# Altium project fast-open-switch r1.0.PrjPcb (part 6 of 8)

## Sheet I2C Multiplexer.SchDoc
size A3; SheetNumber: 17; SheetTotal: 22
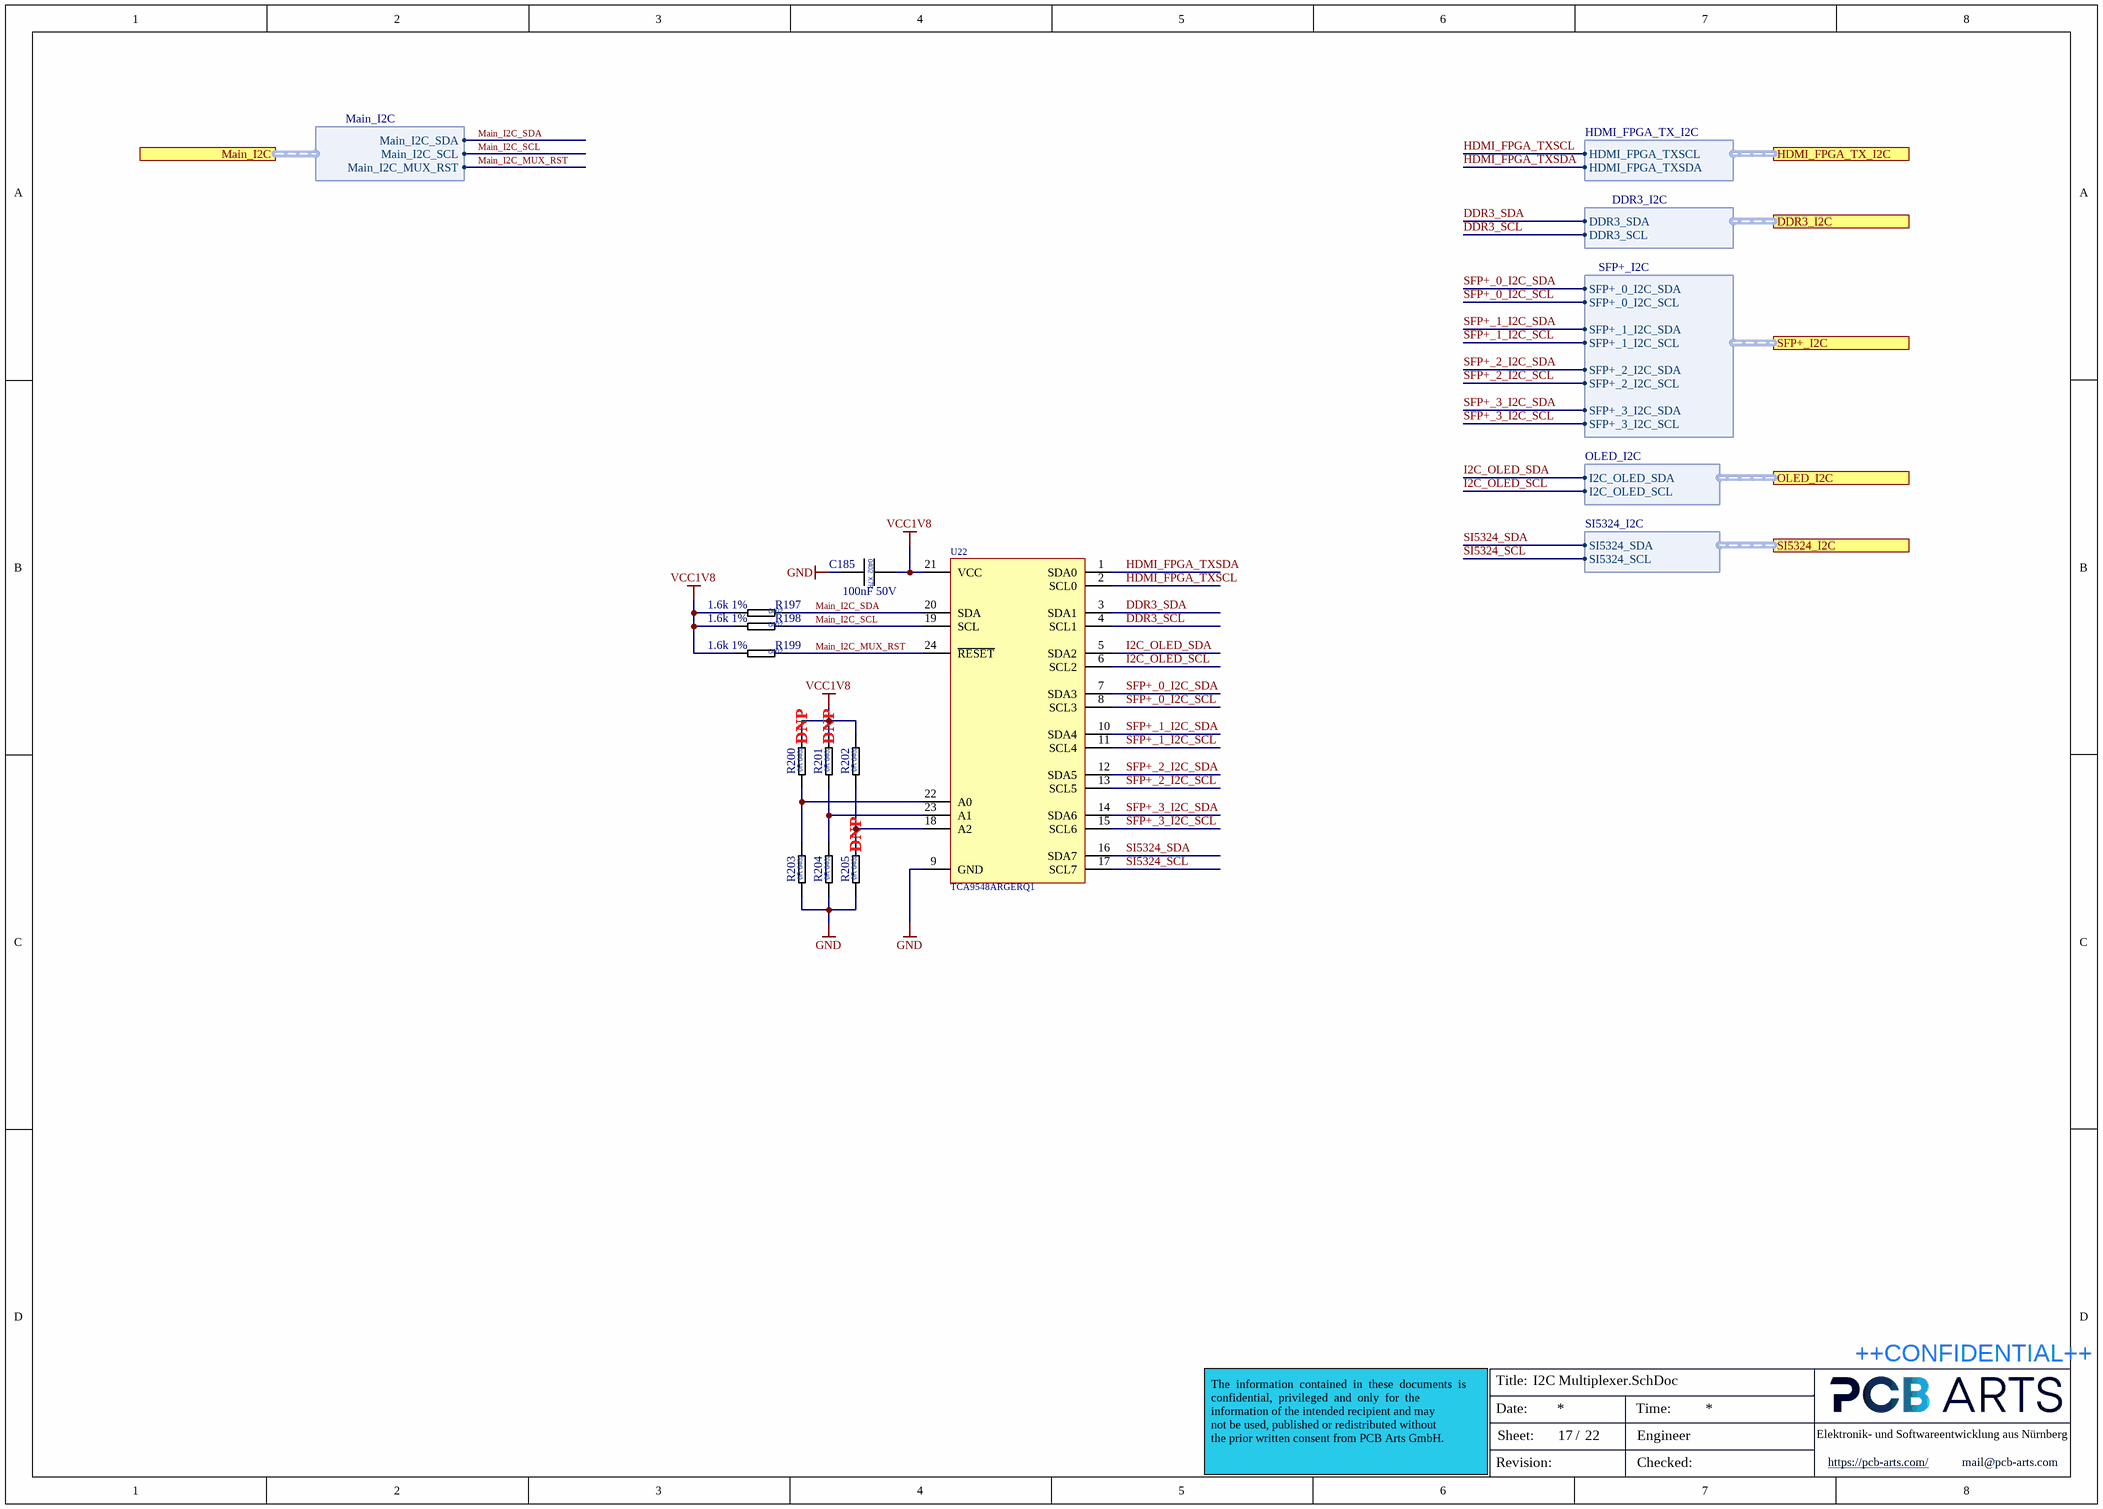
[diagram p16: I2C Multiplexer.SchDoc]

### Parts
C185  100nF 50V  [CAP_0402_L]
R197  1.6k 1%  [RES_0402_L]
R198  1.6k 1%  [RES_0402_L]
R199  1.6k 1%  [RES_0402_L]
R200  0R Jumper  [RES_0402_L]  (value not drawn)  (no BOM)
R201  0R Jumper  [RES_0402_L]  (value not drawn)  (no BOM)
R202  0R Jumper  [RES_0402_L]  (value not drawn)
R203  0R Jumper  [RES_0402_L]  (value not drawn)
R204  0R Jumper  [RES_0402_L]  (value not drawn)
R205  0R Jumper  [RES_0402_L]  (value not drawn)  (no BOM)
U22  TCA9548ARGERQ1  [QFN50P400X400X100-25N]

### Ports
DDR3_I2C (harness DDR3_I2C, see Top-Level-Sheet[6C], DDR3 Memory_SO-DIMM[8C]), HDMI_FPGA_TX_I2C (harness HDMI_FPGA_TX_I2C, see Top-Level-Sheet[6C], Bank 13_Bank 15_Bank 16[8C]), Main_I2C (harness Main_I2C, see Top-Level-Sheet[6C], SMI Bank 12[1B]), OLED_I2C (harness OLED_I2C, see Top-Level-Sheet[6C], HMI[1A]), SFP+_I2C (harness SFP+_I2C, see Top-Level-Sheet[6C], SFP+_Connectors[8B]), SI5324_I2C (harness SI5324_I2C, see Top-Level-Sheet[6C], System Clocks[1A])

### Harnesses
HDMI_FPGA_TX_I2C: HDMI_FPGA_TXSCL, HDMI_FPGA_TXSDA
DDR3_I2C: DDR3_SDA, DDR3_SCL
SFP+_I2C: SFP+_3_I2C_SDA, SFP+_3_I2C_SCL, SFP+_0_I2C_SDA, SFP+_0_I2C_SCL, SFP+_1_I2C_SDA, SFP+_1_I2C_SCL, SFP+_2_I2C_SDA, SFP+_2_I2C_SCL
OLED_I2C: I2C_OLED_SDA, I2C_OLED_SCL
Main_I2C: Main_I2C_SCL, Main_I2C_MUX_RST, Main_I2C_SDA
SI5324_I2C: SI5324_SDA, SI5324_SCL

### Nets
GND: C185.2 R203.1 R204.1 R205.1 U22.9(GND)
VCC1V8: C185.1 R197.2 R198.2 R199.2 R200.2 R201.2 R202.2 U22.21(VCC)
DDR3_SCL: U22.4(SCL1) ; port DDR3_I2C.DDR3_SCL
DDR3_SDA: U22.3(SDA1) ; port DDR3_I2C.DDR3_SDA
HDMI_FPGA_TXSCL: U22.2(SCL0) ; port HDMI_FPGA_TX_I2C.HDMI_FPGA_TXSCL
HDMI_FPGA_TXSDA: U22.1(SDA0) ; port HDMI_FPGA_TX_I2C.HDMI_FPGA_TXSDA
I2C_OLED_SCL: U22.6(SCL2) ; port OLED_I2C.I2C_OLED_SCL
I2C_OLED_SDA: U22.5(SDA2) ; port OLED_I2C.I2C_OLED_SDA
Main_I2C_MUX_RST: R199.1 U22.24(~{RESET}) ; port Main_I2C.Main_I2C_MUX_RST
Main_I2C_SCL: R198.1 U22.19(SCL) ; port Main_I2C.Main_I2C_SCL
Main_I2C_SDA: R197.1 U22.20(SDA) ; port Main_I2C.Main_I2C_SDA
SFP+_0_I2C_SCL: U22.8(SCL3) ; port SFP+_I2C.SFP+_0_I2C_SCL
SFP+_0_I2C_SDA: U22.7(SDA3) ; port SFP+_I2C.SFP+_0_I2C_SDA
SFP+_1_I2C_SCL: U22.11(SCL4) ; port SFP+_I2C.SFP+_1_I2C_SCL
SFP+_1_I2C_SDA: U22.10(SDA4) ; port SFP+_I2C.SFP+_1_I2C_SDA
SFP+_2_I2C_SCL: U22.13(SCL5) ; port SFP+_I2C.SFP+_2_I2C_SCL
SFP+_2_I2C_SDA: U22.12(SDA5) ; port SFP+_I2C.SFP+_2_I2C_SDA
SFP+_3_I2C_SCL: U22.15(SCL6) ; port SFP+_I2C.SFP+_3_I2C_SCL
SFP+_3_I2C_SDA: U22.14(SDA6) ; port SFP+_I2C.SFP+_3_I2C_SDA
SI5324_SCL: U22.17(SCL7) ; port SI5324_I2C.SI5324_SCL
SI5324_SDA: U22.16(SDA7) ; port SI5324_I2C.SI5324_SDA
NetR200_1: R200.1 R203.2 U22.22(A0)
NetR201_1: R201.1 R204.2 U22.23(A1)
NetR202_1: R202.1 R205.2 U22.18(A2)

### Notes on the sheet
- (near R200) DNP
- (near R201) DNP
- (near R205) DNP
- Title:
- ++CONFIDENTIAL++
- Date:
- Sheet:
- /
- Time:
- Engineer
- Elektronik- und Softwareentwicklung aus Nürnberg
- The  information  contained  in  these  documents  is  confidential,  privileged  and  only  for  the
  information of the intended recipient and may
  not be used, published or redistributed without
  the prior written consent from PCB Arts GmbH.
- Revision:
- Checked:
- https://pcb-arts.com/
- mail@pcb-arts.com
- (in symbol CAP_0402_100nF_50V) 0402; X7R
- (in symbol RES_0402_0R Jumper) 0R 0402
- (in symbol RES_0402_1.6k_1%) 0402

### Library data of the parts
C185 = CAP_0402_100nF_50V: Multilayer Ceramic Capacitors MLCC - SMD/SMT 0402 50VDC; Manufacturer 1: Murata Electronics; Manufacturer 1 Prt. Nr.: GCM155L8EH104KE07D; Manufacturer 2 Prt. Nr.: UMK105B7104KV-FR; Manufacturer 2: TDK
R197-R199 = RES_0402_1.6k_1%: Thick Film Resistors - SMD 1.6kOhm 1%; Manufacturer 1: Vishay / Dale; Manufacturer 1 Prt. Nr.: CRCW04021K60FKEDC; Manufacturer 2 Prt. Nr.: RC0402FR-7W1K6L; Manufacturer 2: Yageo
R200-R205 = RES_0402_0R Jumper: Thick Film Resistors - SMD 0Ohm; Manufacturer 1: Vishay / Dale; Manufacturer 1 Prt. Nr.: CRCW04020000Z0EDC; Manufacturer 2 Prt. Nr.: RC0402JR-070RL; Manufacturer 2: Yageo
U22 = TCA9548ARGERQ1_8-Channel I2C Switch with Reset: Automotive 8-Channel I2C Switch with Reset; Manufacturer 1: Texas Instruments; Manufacturer 1 Prt. Nr.: TCA9548ARGERQ1

## Sheet System Clocks.SchDoc
size A3; SheetNumber: 18; SheetTotal: 22
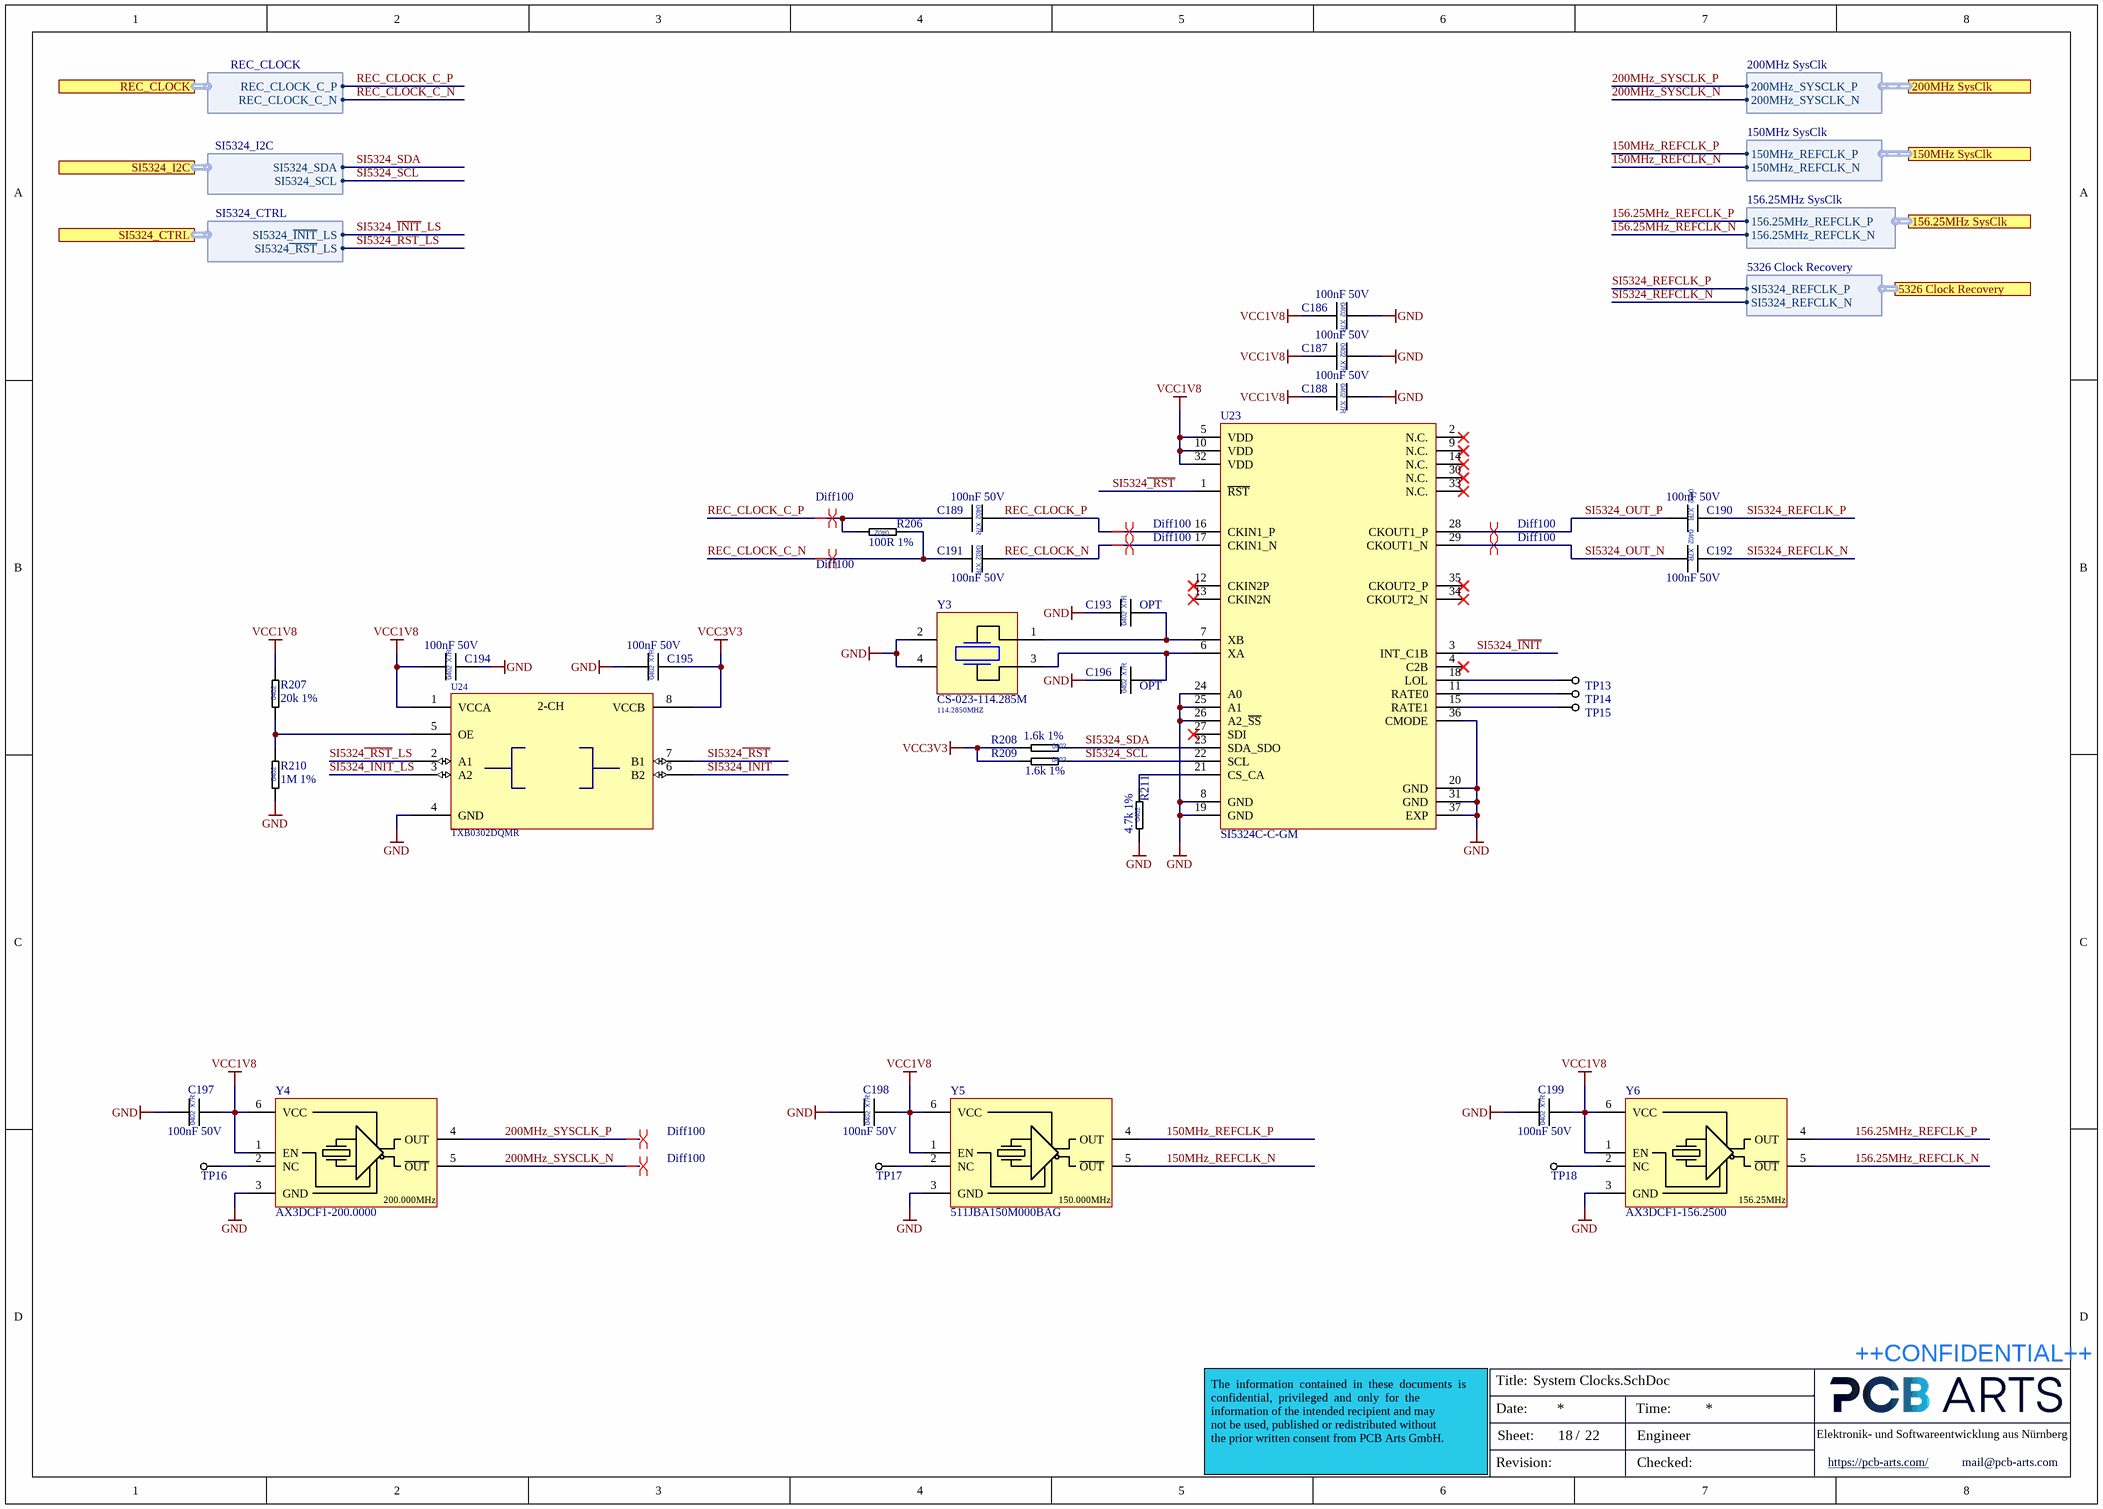
[diagram p17: System Clocks.SchDoc]

### Parts
C186  100nF 50V  [CAP_0402_L]
C187  100nF 50V  [CAP_0402_L]
C188  100nF 50V  [CAP_0402_L]
C189  100nF 50V  [CAP_0402_L]
C190  100nF 50V  [CAP_0402_L]
C191  100nF 50V  [CAP_0402_L]
C192  100nF 50V  [CAP_0402_L]
C193  OPT  [CAP_0402_L]
C194  100nF 50V  [CAP_0402_L]
C195  100nF 50V  [CAP_0402_L]
C196  OPT  [CAP_0402_L]
C197  100nF 50V  [CAP_0402_L]
C198  100nF 50V  [CAP_0402_L]
C199  100nF 50V  [CAP_0402_L]
R206  100R 1%  [RES_0402_L]
R207  20k 1%  [RES_0402_L]
R208  1.6k 1%  [RES_0402_L]
R209  1.6k 1%  [RES_0402_L]
R210  1M 1%  [RES_0402_L]
R211  4.7k 1%  [RES_0402_L]
TP13  Testpoint  [Testpoint 0.8mm]  (value not drawn)  (no BOM)
TP14  Testpoint  [Testpoint 0.8mm]  (value not drawn)  (no BOM)
TP15  Testpoint  [Testpoint 0.8mm]  (value not drawn)  (no BOM)
TP16  Testpoint  [Testpoint 0.8mm]  (value not drawn)  (no BOM)
TP17  Testpoint  [Testpoint 0.8mm]  (value not drawn)  (no BOM)
TP18  Testpoint  [Testpoint 0.8mm]  (value not drawn)  (no BOM)
U23  SI5324C-C-GM  [QFN50P600X600X85-37N]
U24  TXB0302DQMR  [SON40P120X40-8N]
Y3  CS-023-114.285M  Frequency: 114.2850MHZ  [S3D - Shenzhen SCTF Elec]
Y4  AX3DCF1-200.0000  [Abracon AX3]
Y5  511JBA150M000BAG  [Abracon AX3]
Y6  AX3DCF1-156.2500  [Abracon AX3]

### Ports
150MHz SysClk (harness 150MHz SysClk, see Top-Level-Sheet[6A], MGT Banks 115-116[8C]), 156.25MHz SysClk (harness 156.25MHz SysClk, see Top-Level-Sheet[6A], MGT Banks 115-116[8D]), 200MHz SysClk (harness 200MHz SysClk, see Top-Level-Sheet[6A], DDR3 Memory_Banks 32-33-34[8C]), 5326 Clock Recovery (harness 5326 Clock Recovery, see Top-Level-Sheet[6B], MGT Banks 115-116[8D]), REC_CLOCK (harness REC_CLOCK, see Top-Level-Sheet[6B], Bank 13_Bank 15_Bank 16[8A]), SI5324_CTRL (harness SI5324_CTRL, see Top-Level-Sheet[6A], SMI Bank 12[1C]), SI5324_I2C (harness SI5324_I2C, see Top-Level-Sheet[6B], I2C Multiplexer[7B])

### Harnesses
150MHz SysClk: 150MHz_REFCLK_P, 150MHz_REFCLK_N
156.25MHz SysClk: 156.25MHz_REFCLK_P, 156.25MHz_REFCLK_N
5326 Clock Recovery: SI5324_REFCLK_P, SI5324_REFCLK_N
200MHz SysClk: 200MHz_SYSCLK_P, 200MHz_SYSCLK_N
REC_CLOCK: REC_CLOCK_C_P, REC_CLOCK_C_N
SI5324_I2C: SI5324_SDA, SI5324_SCL
SI5324_CTRL: SI5324_~{INIT}_LS, SI5324~{_RST}_LS

### Nets
GND: C186.1 C187.1 C188.1 C193.1 C194.2 C195.1 C196.1 C197.1 C198.1 C199.1 R210.1 R211.1 U23.8(GND) U23.19(GND) U23.20(GND) U23.24(A0) U23.25(A1) U23.26(A2_~{SS}) U23.31(GND) U23.36(CMODE) U23.37(EXP) U24.4(GND) Y3.2 Y3.4 Y4.3(GND) Y5.3(GND) Y6.3(GND)
VCC1V8: C186.2 C187.2 C188.2 C194.1 C197.2 C198.2 C199.2 R207.2 U23.5(VDD) U23.10(VDD) U23.32(VDD) U24.1(VCCA) Y4.1(EN) Y4.6(VCC) Y5.1(EN) Y5.6(VCC) Y6.1(EN) Y6.6(VCC)
VCC3V3: C195.2 R208.2 R209.2 U24.8(VCCB)
150MHz_REFCLK_N: Y5.5(~{OUT}) ; port 150MHz SysClk.150MHz_REFCLK_N
150MHz_REFCLK_P: Y5.4(OUT) ; port 150MHz SysClk.150MHz_REFCLK_P
156.25MHz_REFCLK_N: Y6.5(~{OUT}) ; port 156.25MHz SysClk.156.25MHz_REFCLK_N
156.25MHz_REFCLK_P: Y6.4(OUT) ; port 156.25MHz SysClk.156.25MHz_REFCLK_P
200MHz_SYSCLK_N: Y4.5(~{OUT}) ; port 200MHz SysClk.200MHz_SYSCLK_N
200MHz_SYSCLK_P: Y4.4(OUT) ; port 200MHz SysClk.200MHz_SYSCLK_P
REC_CLOCK_C_N: C191.2 R206.1 ; port REC_CLOCK.REC_CLOCK_C_N
REC_CLOCK_C_P: C189.2 R206.2 ; port REC_CLOCK.REC_CLOCK_C_P
REC_CLOCK_N: C191.1 U23.17(CKIN1_N)
REC_CLOCK_P: C189.1 U23.16(CKIN1_P)
SI5324~{_RST}: U23.1(~{RST}) U24.7(B1)
SI5324~{_RST}_LS: U24.2(A1) ; port SI5324_CTRL.SI5324~{_RST}_LS
SI5324_~{INIT}: U23.3(INT_C1B) U24.6(B2)
SI5324_~{INIT}_LS: U24.3(A2) ; port SI5324_CTRL.SI5324_~{INIT}_LS
SI5324_OUT_N: C192.1 U23.29(CKOUT1_N)
SI5324_OUT_P: C190.1 U23.28(CKOUT1_P)
SI5324_REFCLK_N: C192.2 ; port 5326 Clock Recovery.SI5324_REFCLK_N
SI5324_REFCLK_P: C190.2 ; port 5326 Clock Recovery.SI5324_REFCLK_P
SI5324_SCL: R209.1 U23.22(SCL) ; port SI5324_I2C.SI5324_SCL
SI5324_SDA: R208.1 U23.23(SDA_SDO) ; port SI5324_I2C.SI5324_SDA
NetC193_2: C193.2 U23.7(XB) Y3.1
NetC196_2: C196.2 U23.6(XA) Y3.3
NetR207_1: R207.1 R210.2 U24.5(OE)
NetR211_2: R211.2 U23.21(CS_CA)
NetTP13_1: TP13.1(GND) U23.18(LOL)
NetTP14_1: TP14.1(GND) U23.11(RATE0)
NetTP15_1: TP15.1(GND) U23.15(RATE1)
NetTP16_1: TP16.1(GND) Y4.2(NC)
NetTP17_1: TP17.1(GND) Y5.2(NC)
NetTP18_1: TP18.1(GND) Y6.2(NC)

Not connected (* = marked no-connect by the designer): U23 2(N.C.)* 4(C2B)* 9(N.C.)* 12(CKIN2P)* 13(CKIN2N)* 14(N.C.)* 27(SDI)* 30(N.C.)* 33(N.C.)* 34(CKOUT2_N)* 35(CKOUT2_P)*

### Layout directives
differential pair; net class Diff100: 200MHz_SYSCLK_N, 200MHz_SYSCLK_P, REC_CLOCK_C_N, REC_CLOCK_C_P, REC_CLOCK_N, REC_CLOCK_P, SI5324_OUT_N, SI5324_OUT_P

### Notes on the sheet
- Title:
- ++CONFIDENTIAL++
- Date:
- Sheet:
- /
- Time:
- Engineer
- Elektronik- und Softwareentwicklung aus Nürnberg
- The  information  contained  in  these  documents  is  confidential,  privileged  and  only  for  the
  information of the intended recipient and may
  not be used, published or redistributed without
  the prior written consent from PCB Arts GmbH.
- Revision:
- Checked:
- https://pcb-arts.com/
- mail@pcb-arts.com
- (in symbol 511JBA150M000BAG_150MHz Clock Oscillator, 1V8, LVDS) 150.000MHz
- (in symbol AX3DCF1-156.2500_156.25MHz Clock Oscillator, 1V8, LVDS) 156.25MHz
- (in symbol AX3DCF1-200.0000_200MHz Clock Oscillator, 1V8, LVDS) 200.000MHz
- (in symbol CAP_0402_100nF_50V) 0402; X7R
- (in symbol CAP_0402_OPT) X7R; 0402
- (in symbol RES_0402_1.6k_1%) 0402
- (in symbol RES_0402_1M_1%) 0402
- (in symbol RES_0402_4.7k_1%) 0402
- (in symbol RES_0402_20k_1%) 0402
- (in symbol RES_0402_100R_1%) 0402
- (in symbol TXB0302DQMR_Translation - Voltage Levels 2B Bidir Vltg-Level Translator) 2-CH

### Library data of the parts
C186-C192 C194 C195 C197-C199 = CAP_0402_100nF_50V: as C185 on sheet I2C Multiplexer; Manufacturer 2: TDK
C193 C196 = CAP_0402_OPT: Multilayer Ceramic Capacitors MLCC - SMD/SMT 0402 Optional Placeholder
R206 = RES_0402_100R_1%: Thick Film Resistors - SMD 100Ohm 1%; Manufacturer 1: Vishay / Dale; Manufacturer 1 Prt. Nr.: CRCW0402100RFKEE; Manufacturer 2 Prt. Nr.: RC0402FR-7W100RL; Manufacturer 2: Yageo
R207 = RES_0402_20k_1%: Thick Film Resistors - SMD 20kOhm 1%; Manufacturer 1: Vishay / Dale; Manufacturer 1 Prt. Nr.: CRCW040220K0FKEDC; Manufacturer 2 Prt. Nr.: RC0402FR-7D20KL; Manufacturer 2: Yageo
R208 R209 = RES_0402_1.6k_1%: as R197-R199 on sheet I2C Multiplexer; Manufacturer 2: Yageo
R210 = RES_0402_1M_1%: Thick Film Resistors - SMD 1MOhm 1%; Manufacturer 1: Vishay / Dale; Manufacturer 1 Prt. Nr.: CRCW04021M00FKEDC; Manufacturer 2 Prt. Nr.: RC0402FR-071ML; Manufacturer 2: Yageo
R211 = RES_0402_4.7k_1%: Thick Film Resistors - SMD 4.7kOhm 1%; Manufacturer 1: Vishay / Dale; Manufacturer 1 Prt. Nr.: CRCW04024K70FKEDC; Manufacturer 2 Prt. Nr.: RC0402FR-134K7L; Manufacturer 2: Yageo
TP13-TP18 = Testpoint 0.8mm
U23 = SI5324C-C-GM_PRECISION CLOCK MULTIPLIER/ JITTER ATTENUATOR: PRECISION CLOCK MULTIPLIER/ JITTER ATTENUATOR; Manufacturer 1: Skyworks Solutions, Inc.; Manufacturer 1 Prt. Nr.: SI5324C-C-GM
U24 = TXB0302DQMR_Translation - Voltage Levels 2B Bidir Vltg-Level Translator: Translation - Voltage Levels 2B Bidir Vltg-Level Translator; Manufacturer 1: Texas Instruments; Manufacturer 1 Prt. Nr.: TXB0302DQMR
Y3 = Quarz 114.2850MHz ESR 80R 18pF: 3.2 x 2.5 x 0.8 mm SMD Crystal; Manufacturer 1: Connor Winfield; Manufacturer 1 Prt. Nr.: CS-023-114.285M
Y4 = AX3DCF1-200.0000_200MHz Clock Oscillator, 1V8, LVDS: 200MHz Clock Oscillator, 1V8, LVDS; Manufacturer 1: Abracon; Manufacturer 1 Prt. Nr.: AX3DCF1-200.0000
Y5 = 511JBA150M000BAG_150MHz Clock Oscillator, 1V8, LVDS: 150MHz Clock Oscillator, 1V8, LVDS; Manufacturer 1: Skyworks Solutions, Inc.; Manufacturer 1 Prt. Nr.: 511JBA150M000BAG
Y6 = AX3DCF1-156.2500_156.25MHz Clock Oscillator, 1V8, LVDS: 156.25MHz Clock Oscillator, 1V8, LVDS; Manufacturer 1: Abracon; Manufacturer 1 Prt. Nr.: AX3DCF1-156.2500

## Sheet FPGA Supply Pins.SchDoc
size A3; SheetNumber: 19; SheetTotal: 22
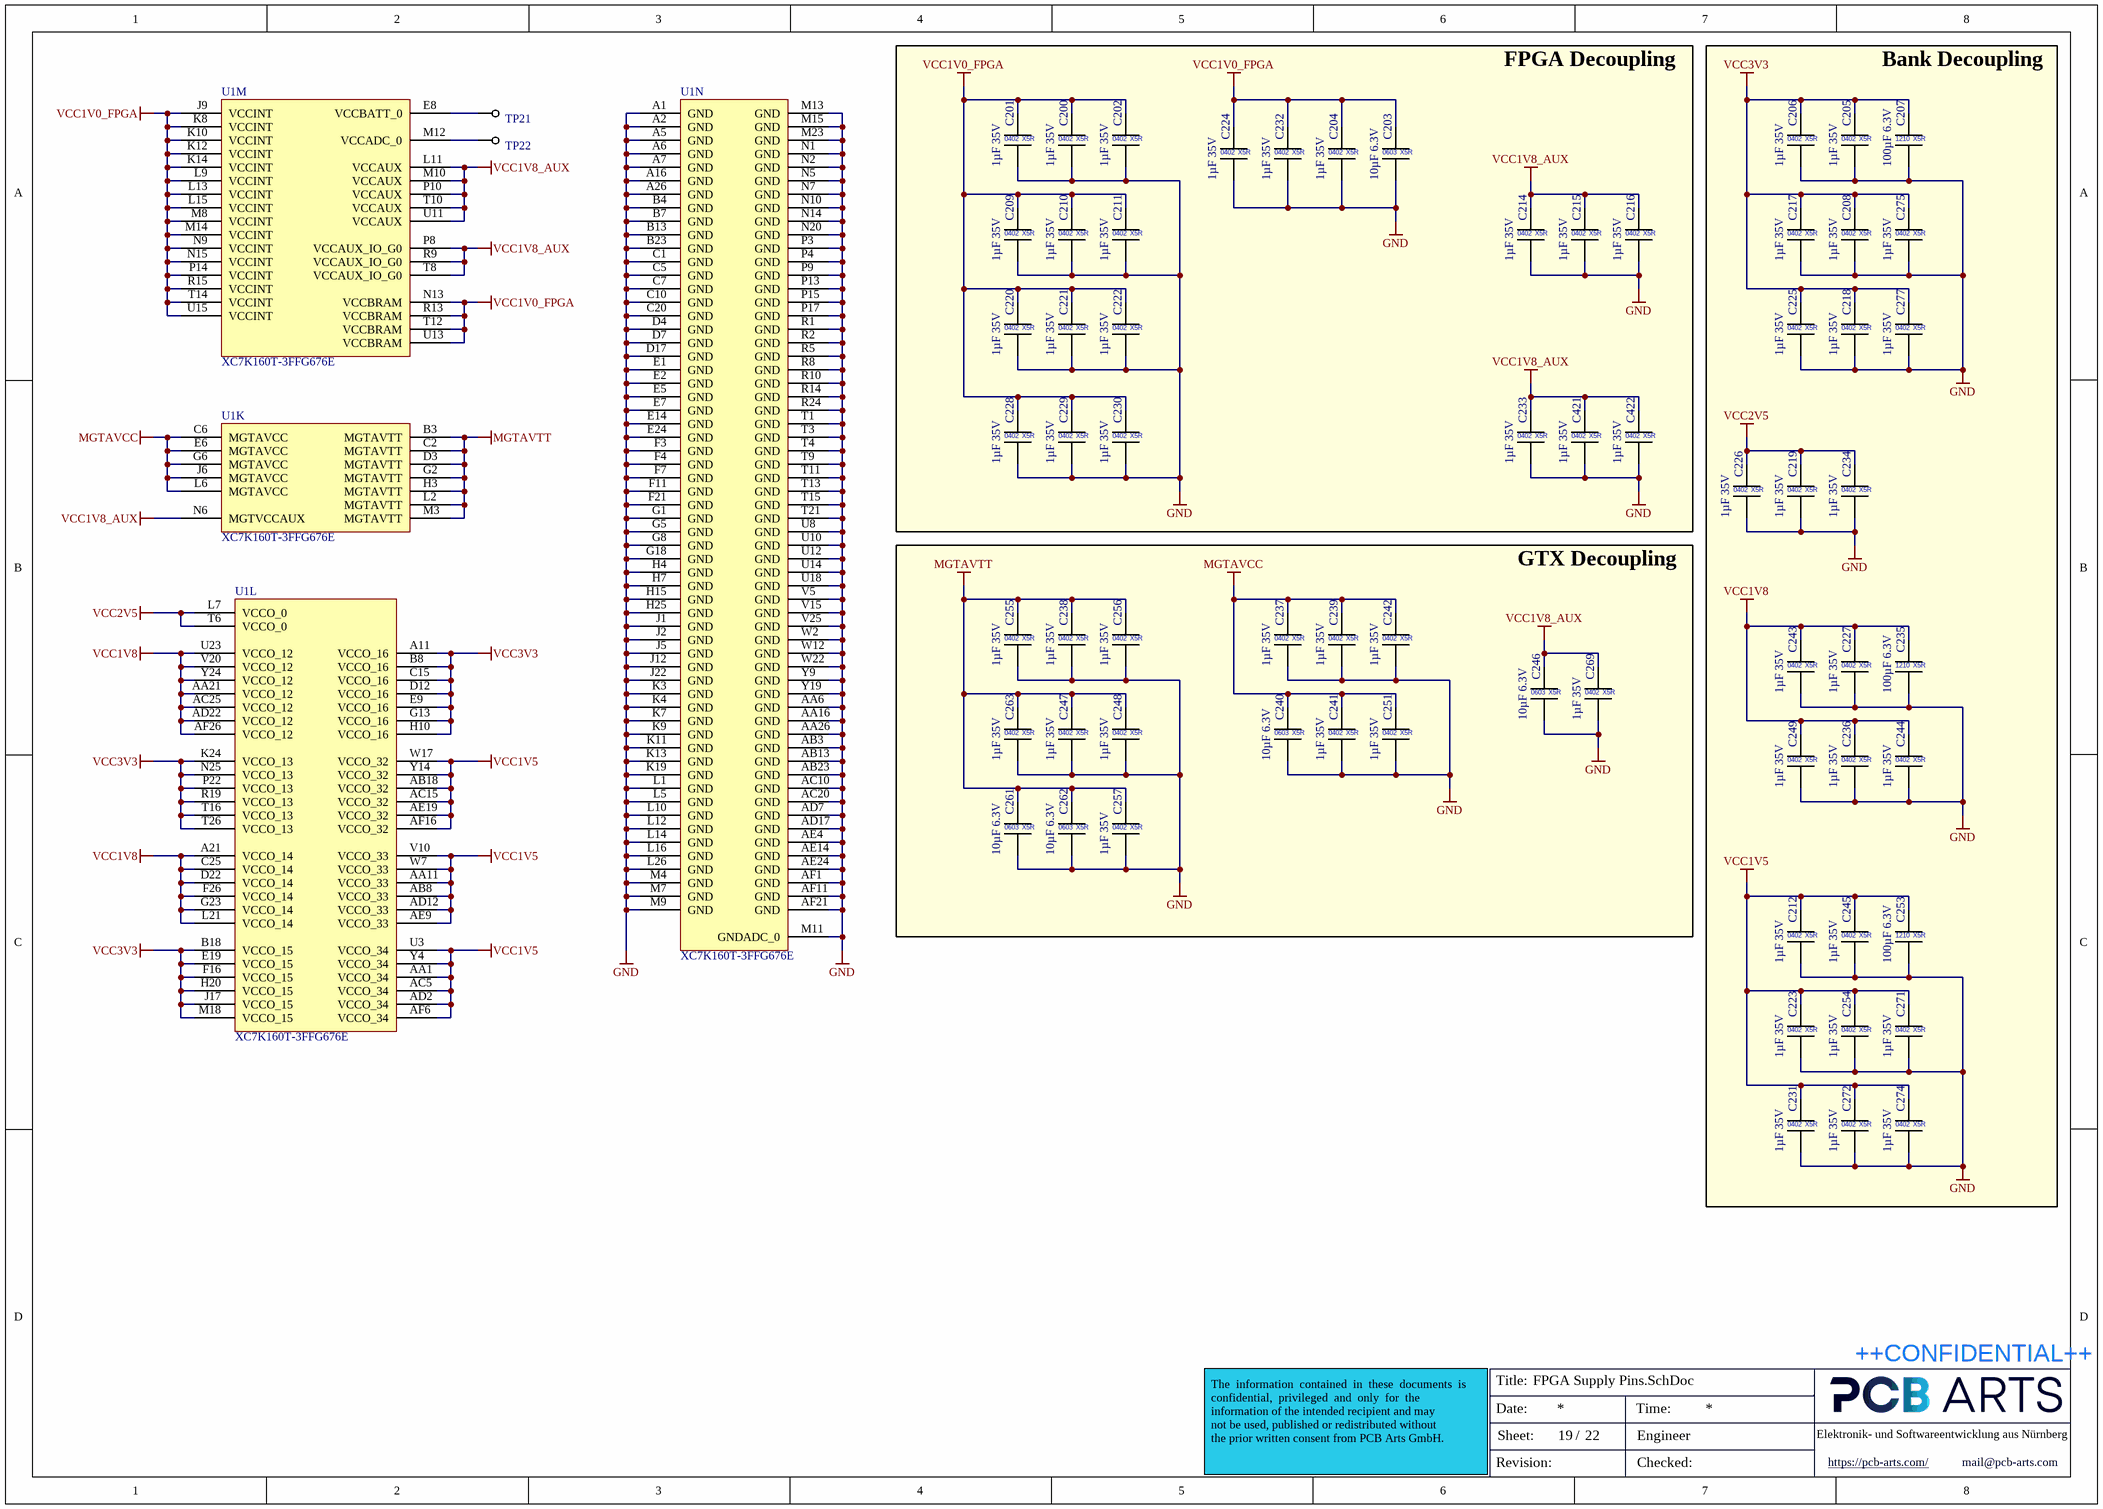
[diagram p18: FPGA Supply Pins.SchDoc]

### Parts
C200  1µF 35V  [CAP_0402_L]
C201  1µF 35V  [CAP_0402_L]
C202  1µF 35V  [CAP_0402_L]
C203  10µF 6.3V  [CAP_0603_L]
C204  1µF 35V  [CAP_0402_L]
C205  1µF 35V  [CAP_0402_L]
C206  1µF 35V  [CAP_0402_L]
C207  100µF 6.3V  [CAP_1210]
C208  1µF 35V  [CAP_0402_L]
C209  1µF 35V  [CAP_0402_L]
C210  1µF 35V  [CAP_0402_L]
C211  1µF 35V  [CAP_0402_L]
C212  1µF 35V  [CAP_0402_L]
C214  1µF 35V  [CAP_0402_L]
C215  1µF 35V  [CAP_0402_L]
C216  1µF 35V  [CAP_0402_L]
C217  1µF 35V  [CAP_0402_L]
C218  1µF 35V  [CAP_0402_L]
C219  1µF 35V  [CAP_0402_L]
C220  1µF 35V  [CAP_0402_L]
C221  1µF 35V  [CAP_0402_L]
C222  1µF 35V  [CAP_0402_L]
C223  1µF 35V  [CAP_0402_L]
C224  1µF 35V  [CAP_0402_L]
C225  1µF 35V  [CAP_0402_L]
C226  1µF 35V  [CAP_0402_L]
C227  1µF 35V  [CAP_0402_L]
C228  1µF 35V  [CAP_0402_L]
C229  1µF 35V  [CAP_0402_L]
C230  1µF 35V  [CAP_0402_L]
C231  1µF 35V  [CAP_0402_L]
C232  1µF 35V  [CAP_0402_L]
C233  1µF 35V  [CAP_0402_L]
C234  1µF 35V  [CAP_0402_L]
C235  100µF 6.3V  [CAP_1210]
C236  1µF 35V  [CAP_0402_L]
C237  1µF 35V  [CAP_0402_L]
C238  1µF 35V  [CAP_0402_L]
C239  1µF 35V  [CAP_0402_L]
C240  10µF 6.3V  [CAP_0603_L]
C241  1µF 35V  [CAP_0402_L]
C242  1µF 35V  [CAP_0402_L]
C243  1µF 35V  [CAP_0402_L]
C244  1µF 35V  [CAP_0402_L]
C245  1µF 35V  [CAP_0402_L]
C246  10µF 6.3V  [CAP_0603_L]
C247  1µF 35V  [CAP_0402_L]
C248  1µF 35V  [CAP_0402_L]
C249  1µF 35V  [CAP_0402_L]
C251  1µF 35V  [CAP_0402_L]
C253  100µF 6.3V  [CAP_1210]
C254  1µF 35V  [CAP_0402_L]
C255  1µF 35V  [CAP_0402_L]
C256  1µF 35V  [CAP_0402_L]
C257  1µF 35V  [CAP_0402_L]
C261  10µF 6.3V  [CAP_0603_L]
C262  10µF 6.3V  [CAP_0603_L]
C263  1µF 35V  [CAP_0402_L]
C269  1µF 35V  [CAP_0402_L]
C271  1µF 35V  [CAP_0402_L]
C272  1µF 35V  [CAP_0402_L]
C274  1µF 35V  [CAP_0402_L]
C275  1µF 35V  [CAP_0402_L]
C277  1µF 35V  [CAP_0402_L]
C421  1µF 35V  [CAP_0402_L]
C422  1µF 35V  [CAP_0402_L]
TP21  Testpoint  [Testpoint 0.8mm]  (value not drawn)  (no BOM)
TP22  Testpoint  [Testpoint 0.8mm]  (value not drawn)  (no BOM)
U1  XC7K160T-3FFG676E  [BGA100P2700X2700X317-676N]  (parts K,L,M,N of 14)

### Blocks framed on the sheet
FPGA Decoupling: C200-C204 C209-C211 C214-C216 C220-C222 C224 C228-C230 C232 C233 C421 C422
Bank Decoupling: C205-C208 C212 C217-C219 C223 C225-C227 C231 C234-C236 C243-C245 C249 C253 C254 C271 C272 C274 C275 C277
GTX Decoupling: C237-C242 C246-C248 C251 C255-C257 C261-C263 C269

### Nets
GND: C200.2 C201.2 C202.2 C203.2 C204.2 C205.2 C206.2 C207.2 C208.2 C209.2 C210.2 C211.2 C212.2 C214.2 C215.2 C216.2 C217.2 C218.2 C219.2 C220.2 C221.2 C222.2 C223.2 C224.2 C225.2 C226.2 C227.2 C228.2 C229.2 C230.2 C231.2 C232.2 C233.2 C234.2 C235.2 C236.2 C237.2 C238.2 C239.2 C240.2 C241.2 C242.2 C243.2 C244.2 C245.2 C246.2 C247.2 C248.2 C249.2 C251.2 C253.2 C254.2 C255.2 C256.2 C257.2 C261.2 C262.2 C263.2 C269.2 C271.2 C272.2 C274.2 C275.2 C277.2 C421.2 C422.2 U1.A1(GND) U1.A2(GND) U1.A5(GND) U1.A6(GND) U1.A7(GND) U1.A16(GND) U1.A26(GND) U1.AA6(GND) U1.AA16(GND) U1.AA26(GND) U1.AB3(GND) U1.AB13(GND) U1.AB23(GND) U1.AC10(GND) U1.AC20(GND) U1.AD7(GND) U1.AD17(GND) U1.AE4(GND) U1.AE14(GND) U1.AE24(GND) U1.AF1(GND) U1.AF11(GND) U1.AF21(GND) U1.B4(GND) U1.B7(GND) U1.B13(GND) U1.B23(GND) U1.C1(GND) U1.C5(GND) U1.C7(GND) U1.C10(GND) U1.C20(GND) U1.D4(GND) U1.D7(GND) U1.D17(GND) U1.E1(GND) U1.E2(GND) U1.E5(GND) U1.E7(GND) U1.E14(GND) U1.E24(GND) U1.F3(GND) U1.F4(GND) U1.F7(GND) U1.F11(GND) U1.F21(GND) U1.G1(GND) U1.G5(GND) U1.G8(GND) U1.G18(GND) U1.H4(GND) U1.H7(GND) U1.H15(GND) U1.H25(GND) U1.J1(GND) U1.J2(GND) U1.J5(GND) U1.J12(GND) U1.J22(GND) U1.K3(GND) U1.K4(GND) U1.K7(GND) U1.K9(GND) U1.K11(GND) U1.K13(GND) U1.K19(GND) U1.L1(GND) U1.L5(GND) U1.L10(GND) U1.L12(GND) U1.L14(GND) U1.L16(GND) U1.L26(GND) U1.M4(GND) U1.M7(GND) U1.M9(GND) U1.M11(GNDADC_0) U1.M13(GND) U1.M15(GND) U1.M23(GND) U1.N1(GND) U1.N2(GND) U1.N5(GND) U1.N7(GND) U1.N10(GND) U1.N14(GND) U1.N20(GND) U1.P3(GND) U1.P4(GND) U1.P9(GND) U1.P13(GND) U1.P15(GND) U1.P17(GND) U1.R1(GND) U1.R2(GND) U1.R5(GND) U1.R8(GND) U1.R10(GND) U1.R14(GND) U1.R24(GND) U1.T1(GND) U1.T3(GND) U1.T4(GND) U1.T9(GND) U1.T11(GND) U1.T13(GND) U1.T15(GND) U1.T21(GND) U1.U8(GND) U1.U10(GND) U1.U12(GND) U1.U14(GND) U1.U18(GND) U1.V5(GND) U1.V15(GND) U1.V25(GND) U1.W2(GND) U1.W12(GND) U1.W22(GND) U1.Y9(GND) U1.Y19(GND)
MGTAVCC: C237.1 C239.1 C240.1 C241.1 C242.1 C251.1 U1.C6(MGTAVCC) U1.E6(MGTAVCC) U1.G6(MGTAVCC) U1.J6(MGTAVCC) U1.L6(MGTAVCC)
MGTAVTT: C238.1 C247.1 C248.1 C255.1 C256.1 C257.1 C261.1 C262.1 C263.1 U1.B3(MGTAVTT) U1.C2(MGTAVTT) U1.D3(MGTAVTT) U1.G2(MGTAVTT) U1.H3(MGTAVTT) U1.L2(MGTAVTT) U1.M3(MGTAVTT)
VCC1V0_FPGA: C200.1 C201.1 C202.1 C203.1 C204.1 C209.1 C210.1 C211.1 C220.1 C221.1 C222.1 C224.1 C228.1 C229.1 C230.1 C232.1 U1.J9(VCCINT) U1.K8(VCCINT) U1.K10(VCCINT) U1.K12(VCCINT) U1.K14(VCCINT) U1.L9(VCCINT) U1.L13(VCCINT) U1.L15(VCCINT) U1.M8(VCCINT) U1.M14(VCCINT) U1.N9(VCCINT) U1.N13(VCCBRAM) U1.N15(VCCINT) U1.P14(VCCINT) U1.R13(VCCBRAM) U1.R15(VCCINT) U1.T12(VCCBRAM) U1.T14(VCCINT) U1.U13(VCCBRAM) U1.U15(VCCINT)
VCC1V5: C212.1 C223.1 C231.1 C245.1 C253.1 C254.1 C271.1 C272.1 C274.1 U1.AA1(VCCO_34) U1.AA11(VCCO_33) U1.AB8(VCCO_33) U1.AB18(VCCO_32) U1.AC5(VCCO_34) U1.AC15(VCCO_32) U1.AD2(VCCO_34) U1.AD12(VCCO_33) U1.AE9(VCCO_33) U1.AE19(VCCO_32) U1.AF6(VCCO_34) U1.AF16(VCCO_32) U1.U3(VCCO_34) U1.V10(VCCO_33) U1.W7(VCCO_33) U1.W17(VCCO_32) U1.Y4(VCCO_34) U1.Y14(VCCO_32)
VCC1V8: C227.1 C235.1 C236.1 C243.1 C244.1 C249.1 U1.A21(VCCO_14) U1.AA21(VCCO_12) U1.AC25(VCCO_12) U1.AD22(VCCO_12) U1.AF26(VCCO_12) U1.C25(VCCO_14) U1.D22(VCCO_14) U1.F26(VCCO_14) U1.G23(VCCO_14) U1.L21(VCCO_14) U1.U23(VCCO_12) U1.V20(VCCO_12) U1.Y24(VCCO_12)
VCC1V8_AUX: C214.1 C215.1 C216.1 C233.1 C246.1 C269.1 C421.1 C422.1 U1.L11(VCCAUX) U1.M10(VCCAUX) U1.N6(MGTVCCAUX) U1.P8(VCCAUX_IO_G0) U1.P10(VCCAUX) U1.R9(VCCAUX_IO_G0) U1.T8(VCCAUX_IO_G0) U1.T10(VCCAUX) U1.U11(VCCAUX)
VCC2V5: C219.1 C226.1 C234.1 U1.L7(VCCO_0) U1.T6(VCCO_0)
VCC3V3: C205.1 C206.1 C207.1 C208.1 C217.1 C218.1 C225.1 C275.1 C277.1 U1.A11(VCCO_16) U1.B8(VCCO_16) U1.B18(VCCO_15) U1.C15(VCCO_16) U1.D12(VCCO_16) U1.E9(VCCO_16) U1.E19(VCCO_15) U1.F16(VCCO_15) U1.G13(VCCO_16) U1.H10(VCCO_16) U1.H20(VCCO_15) U1.J17(VCCO_15) U1.K24(VCCO_13) U1.M18(VCCO_15) U1.N25(VCCO_13) U1.P22(VCCO_13) U1.R19(VCCO_13) U1.T16(VCCO_13) U1.T26(VCCO_13)
NetTP21_1: TP21.1(GND) U1.E8(VCCBATT_0)
NetTP22_1: TP22.1(GND) U1.M12(VCCADC_0)

### Notes on the sheet
- Title:
- ++CONFIDENTIAL++
- Date:
- Sheet:
- /
- Time:
- Engineer
- Elektronik- und Softwareentwicklung aus Nürnberg
- The  information  contained  in  these  documents  is  confidential,  privileged  and  only  for  the
  information of the intended recipient and may
  not be used, published or redistributed without
  the prior written consent from PCB Arts GmbH.
- Revision:
- Checked:
- https://pcb-arts.com/
- mail@pcb-arts.com
- (in symbol CAP_0402_1µF_35V) 0402; X5R
- (in symbol CAP_0603_10µF_6.3V) 0603; X5R
- (in symbol CAP_1210_100µF_6.3V) 1210; X5R

### Library data of the parts
C200-C202 C204-C206 C208-C212 C214-C234 C236-C239 C241-C245 C247-C249 C251 C254-C257 C263 C269 C271 C272 C274 C275 C277 C421 C422 = CAP_0402_1µF_35V: Multilayer Ceramic Capacitors MLCC - SMD/SMT 0402 35VDC; Manufacturer 1: Kyocera Electronic Components; Manufacturer 1 Prt. Nr.: CM05X5R105K35AH; Manufacturer 2 Prt. Nr.: C1005X5R1V105K050BC; Manufacturer 2: TDK
C203 C240 C246 C261 C262 = CAP_0603_10µF_6.3V: Multilayer Ceramic Capacitors MLCC - SMD/SMT 0603 6.3VDC; Manufacturer 1: Murata Electronics; Manufacturer 1 Prt. Nr.: GRM188R60J106ME84J; Manufacturer 2 Prt. Nr.: JMK107ABJ106MA-T; Manufacturer 2: Taiyo Yuden
C207 C235 C253 = CAP_1210_100µF_6.3V: Multilayer Ceramic Capacitors MLCC - SMD/SMT 1210 6.3VDC; Manufacturer 1: Samsung Electro-Mechanics; Manufacturer 1 Prt. Nr.: CL32A107MQVNNWE; Manufacturer 2 Prt. Nr.: JMK325ABJ107MMHP; Manufacturer 2: Taiyo Yuden
TP21 TP22 = Testpoint 0.8mm
U1 = XC7K160T-3FFG676E_Kintex-7 FPGA, 400 User I/Os, 8 GTX, FFG676: Kintex-7 FPGA, 400 User I/Os, 8 GTX, 676-Ball BGA, Speed Grade 3, Extended Grade, Pb-Free; Manufacturer 1: Xilinx; Manufacturer 1 Prt. Nr.: XC7K160T-3FFG676E; ComponentLink1URL: http://www.xilinx.com/support/documentation/data_sheets/ds180_7Series_Overview.pdf; ComponentLink2URL: http://www.xilinx.com/support/documentation/user_guides/ug865-Zynq-7000-Pkg-Pinout.pdf; ComponentLink1Description: Datasheet; ComponentLink2Description: Package Specification

## Sheet PWR_CTRL.SchDoc
size A3; SheetNumber: 21; SheetTotal: 22
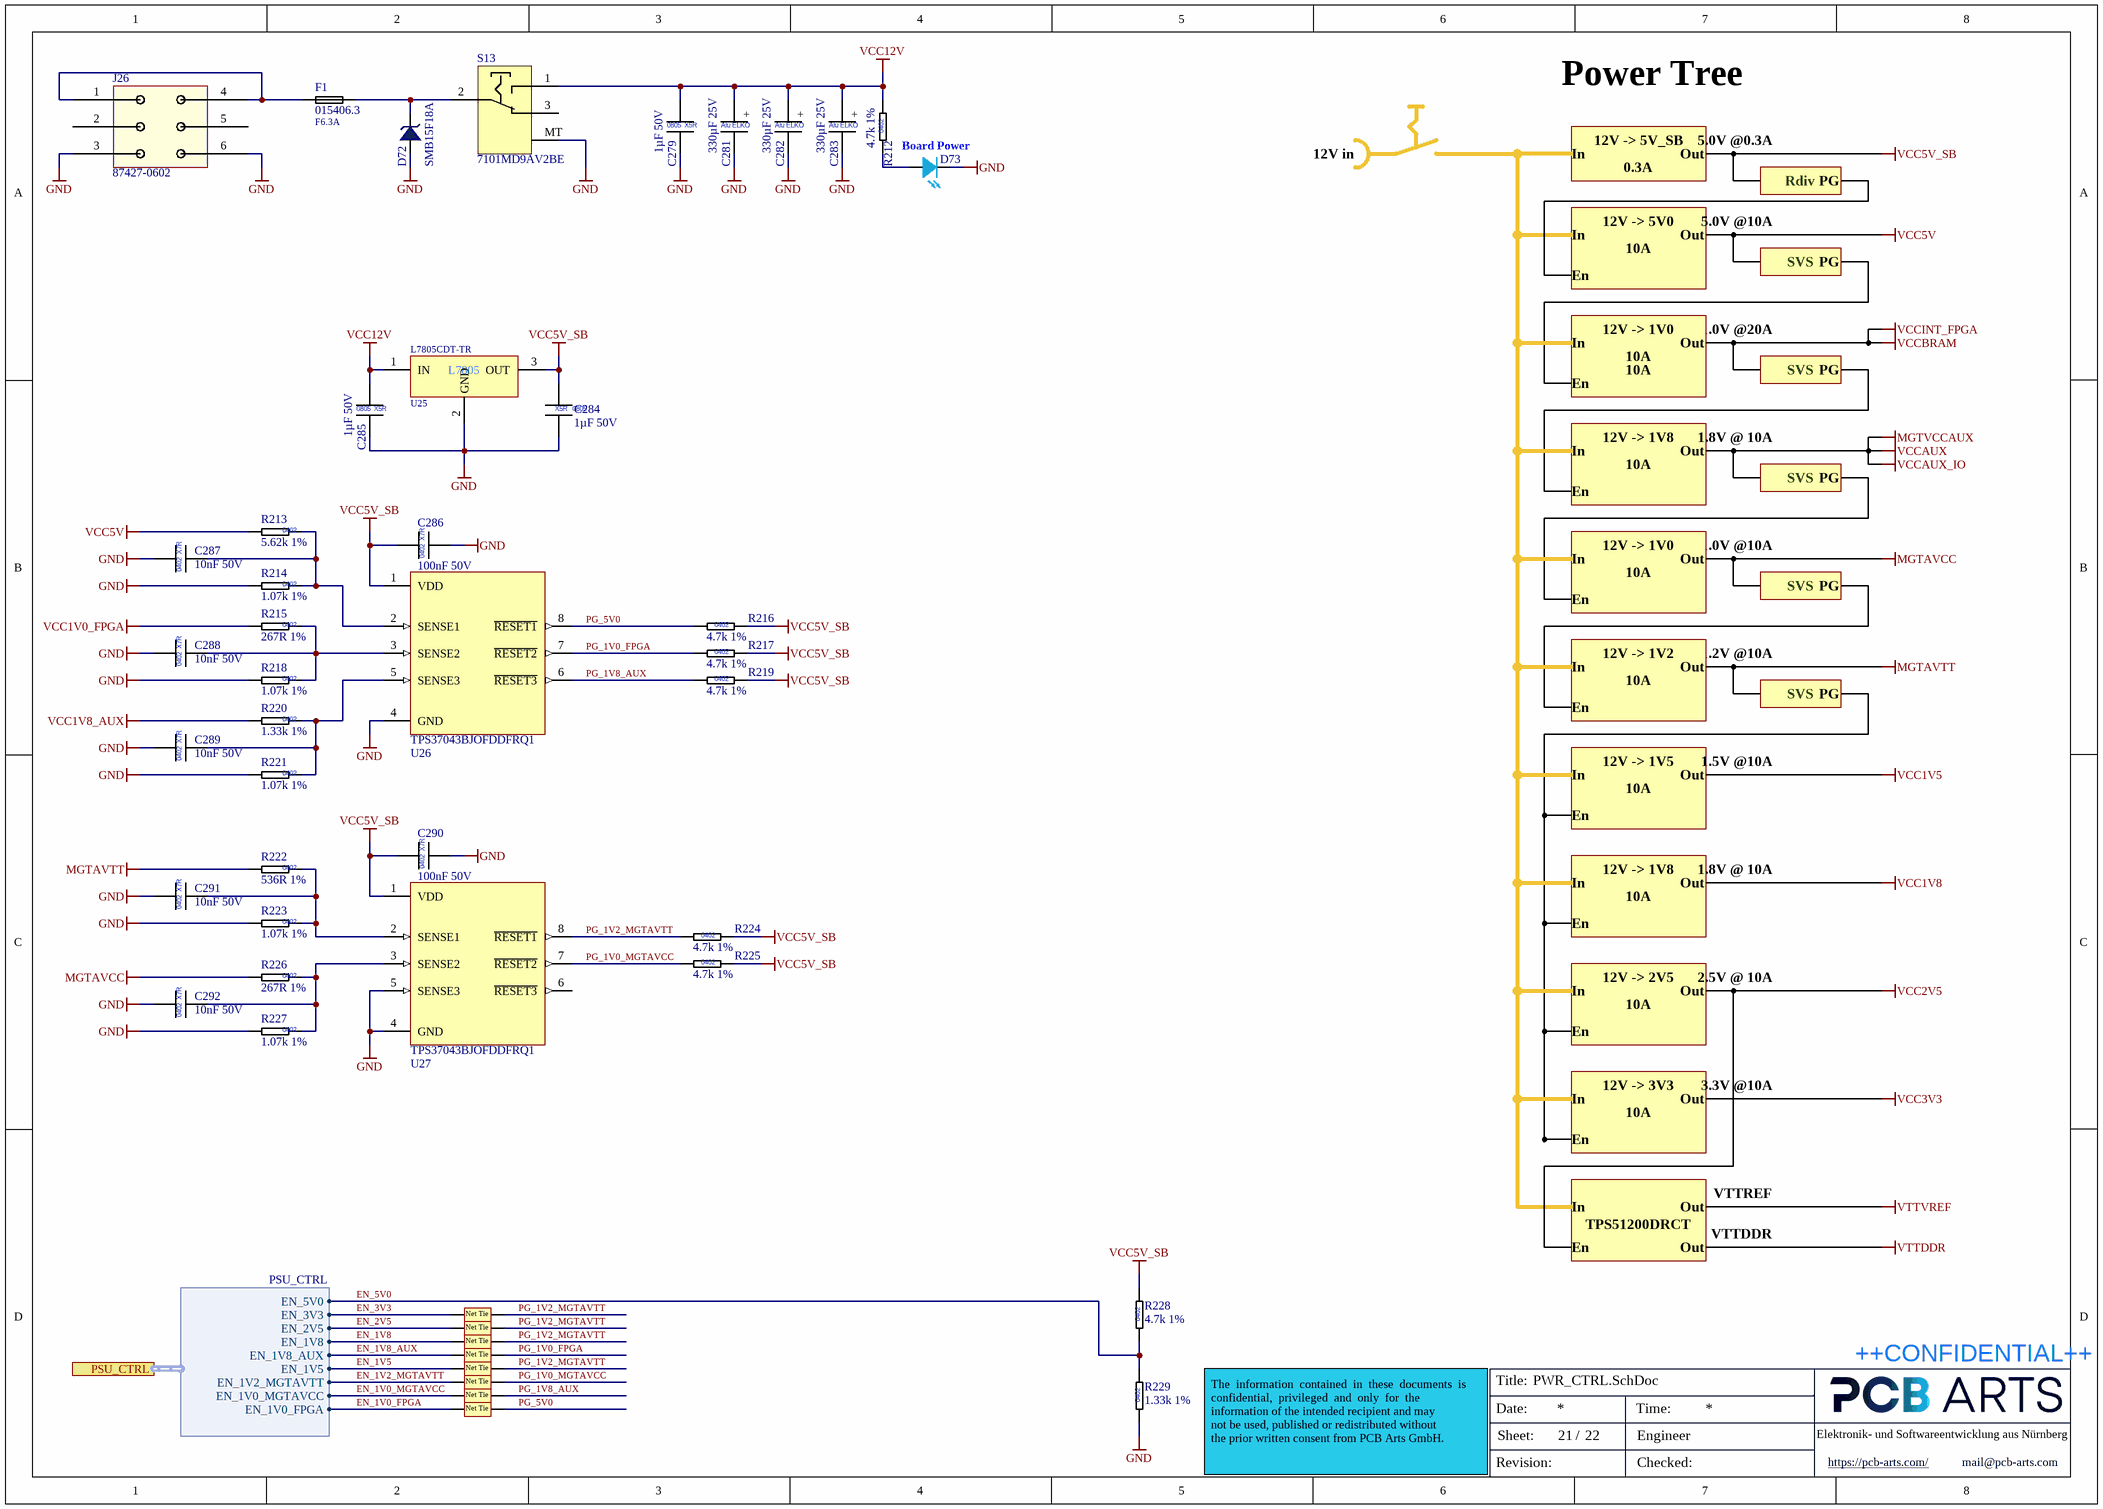
[diagram p19: PWR_CTRL.SchDoc]

### Parts
C279  1µF 50V  [CAP_0805]
C281  330µF 25V  [WCAP-PTG5_D10H12.5]
C282  330µF 25V  [WCAP-PTG5_D10H12.5]
C283  330µF 25V  [WCAP-PTG5_D10H12.5]
C284  1µF 50V  [CAP_0805]
C285  1µF 50V  [CAP_0805]
C286  100nF 50V  [CAP_0402_L]
C287  10nF 50V  [CAP_0402_L]
C288  10nF 50V  [CAP_0402_L]
C289  10nF 50V  [CAP_0402_L]
C290  100nF 50V  [CAP_0402_L]
C291  10nF 50V  [CAP_0402_L]
C292  10nF 50V  [CAP_0402_L]
D72  SMB15F18A  [DO221-AA]
D73  LTST-S270TBKT  [LED-0603 Sideview]  (value not drawn)
F1  015406.3  Current: F6.3A  [154 Series Littelfuse]
J26  87427-0602  [Molex 87427-0602]
NT1  Net Tie  [Net Tie-0.3]  (value not drawn)  (net tie, no BOM)
NT2  Net Tie  [Net Tie-0.3]  (value not drawn)  (net tie, no BOM)
NT3  Net Tie  [Net Tie-0.3]  (value not drawn)  (net tie, no BOM)
NT4  Net Tie  [Net Tie-0.3]  (value not drawn)  (net tie, no BOM)
NT5  Net Tie  [Net Tie-0.3]  (value not drawn)  (net tie, no BOM)
NT6  Net Tie  [Net Tie-0.3]  (value not drawn)  (net tie, no BOM)
NT7  Net Tie  [Net Tie-0.3]  (value not drawn)  (net tie, no BOM)
NT8  Net Tie  [Net Tie-0.3]  (value not drawn)  (net tie, no BOM)
R212  4.7k 1%  [RES_0402_L]
R213  5.62k 1%  [RES_0402_L]
R214  1.07k 1%  [RES_0402_L]
R215  267R 1%  [RES_0402_L]
R216  4.7k 1%  [RES_0402_L]
R217  4.7k 1%  [RES_0402_L]
R218  1.07k 1%  [RES_0402_L]
R219  4.7k 1%  [RES_0402_L]
R220  1.33k 1%  [RES_0402_L]
R221  1.07k 1%  [RES_0402_L]
R222  536R 1%  [RES_0402_L]
R223  1.07k 1%  [RES_0402_L]
R224  4.7k 1%  [RES_0402_L]
R225  4.7k 1%  [RES_0402_L]
R226  267R 1%  [RES_0402_L]
R227  1.07k 1%  [RES_0402_L]
R228  4.7k 1%  [RES_0402_L]
R229  1.33k 1%  [RES_0402_L]
S13  7101MD9AV2BE  [7101MD9AV2BE]
U25  L7805CDT-TR  [DPAK230P991X241-3N]
U26  TPS37043BJOFDDFRQ1  [SOT65P295X160-8N]
U27  TPS37043BJOFDDFRQ1  [SOT65P295X160-8N]

### Ports
PSU_CTRL (harness PSU_CTRL, see Top-Level-Sheet[3C], Buck Modules[1D])

### Harnesses
PSU_CTRL: EN_1V8_AUX, EN_1V5, EN_1V2_MGTAVTT, EN_1V0_MGTAVCC, EN_1V8, EN_1V0_FPGA, EN_2V5, EN_3V3, EN_5V0

### Nets
GND: C279.2 C281.2 C282.2 C283.2 C284.2 C285.2 C286.2 C287.1 C288.1 C289.1 C290.2 C291.1 C292.1 D72.2 D73.1 J26.3 J26.6 R214.2 R218.2 R221.2 R223.2 R227.2 R229.1 S13.MT U25.2(GND) U26.4(GND) U27.4(GND) U27.5(SENSE3)
MGTAVCC: R226.2
MGTAVTT: R222.2
VCC1V0_FPGA: R215.2
VCC1V8_AUX: R220.2
VCC5V: R213.2
VCC5V_SB: C284.1 C286.1 C290.1 R216.2 R217.2 R219.2 R224.2 R225.2 R228.2 U25.3(OUT) U26.1(VDD) U27.1(VDD)
VCC12V: C279.1 C281.1 C282.1 C283.1 C285.1 R212.2 S13.1 U25.1(IN)
EN_1V0_FPGA: NT8.1 ; port PSU_CTRL.EN_1V0_FPGA
EN_1V0_MGTAVCC: NT7.1 ; port PSU_CTRL.EN_1V0_MGTAVCC
EN_1V2_MGTAVTT: NT6.1 ; port PSU_CTRL.EN_1V2_MGTAVTT
EN_1V5: NT5.1 ; port PSU_CTRL.EN_1V5
EN_1V8: NT3.1 ; port PSU_CTRL.EN_1V8
EN_1V8_AUX: NT4.1 ; port PSU_CTRL.EN_1V8_AUX
EN_2V5: NT2.1 ; port PSU_CTRL.EN_2V5
EN_3V3: NT1.1 ; port PSU_CTRL.EN_3V3
EN_5V0: R228.1 R229.2 ; port PSU_CTRL.EN_5V0
PG_1V0_FPGA: NT4.2 R217.1 U26.7(~{RESET2})
PG_1V0_MGTAVCC: NT6.2 R225.1 U27.7(~{RESET2})
PG_1V2_MGTAVTT: NT1.2 NT2.2 NT3.2 NT5.2 R224.1 U27.8(~{RESET1})
PG_1V8_AUX: NT7.2 R219.1 U26.6(~{RESET3})
PG_5V0: NT8.2 R216.1 U26.8(~{RESET1})
NetC287_2: C287.2 R213.1 R214.1 U26.2(SENSE1)
NetC288_2: C288.2 R215.1 R218.1 U26.3(SENSE2)
NetC289_2: C289.2 R220.1 R221.1 U26.5(SENSE3)
NetC291_2: C291.2 R222.1 R223.1 U27.2(SENSE1)
NetC292_2: C292.2 R226.1 R227.1 U27.3(SENSE2)
NetD72_1: D72.1 F1.2 S13.2
NetD73_2: D73.2 R212.1
NetF1_1: F1.1 J26.1 J26.4

Not connected (* = marked no-connect by the designer): J26 2 5; S13 3; U27 6(~{RESET3})

### Notes on the sheet
- Power Tree
- Board Power
- 12V in
- In
- 12V -> 5V_SB
- 0.3A
- Out
- 5.0V @0.3A
- Rdiv
- PG
- 12V -> 5V0
- 10A
- 5.0V @10A
- En
- SVS
- 12V -> 1V0
- 1.0V @20A
- 12V -> 1V8
- 1.8V @ 10A
- 1.0V @10A
- 12V -> 1V2
- 1.2V @10A
- 12V -> 1V5
- 1.5V @10A
- 12V -> 2V5
- 2.5V @ 10A
- 12V -> 3V3
- 3.3V @10A
- VTTREF
- TPS51200DRCT
- VTTDDR
- Labels drawn without touching a wire or pin: MGTAVCC, MGTAVTT, MGTVCCAUX, VCC1V5, VCC1V8, VCC2V5, VCC3V3, VCC5V, VCC5V_SB, VCCAUX, VCCAUX_IO, VCCBRAM, VCCINT_FPGA, VTTDDR, VTTVREF
- Title:
- ++CONFIDENTIAL++
- Date:
- Sheet:
- /
- Time:
- Engineer
- Elektronik- und Softwareentwicklung aus Nürnberg
- The  information  contained  in  these  documents  is  confidential,  privileged  and  only  for  the
  information of the intended recipient and may
  not be used, published or redistributed without
  the prior written consent from PCB Arts GmbH.
- Revision:
- Checked:
- https://pcb-arts.com/
- mail@pcb-arts.com
- (in symbol CAP_0402_10nF_50V) X7R; 0402
- (in symbol CAP_0402_100nF_50V) X7R; 0402
- (in symbol CAP_0805_1µF_50V) 0805; X5R
- (in symbol CAP_D10L12.5_330µF_25V) +; Alu ELKO
- (in symbol L7805CDT-TR_Linear Voltage Regulators 5.0V 1.0A) L7805
- (in symbol RES_0402_1.07k_1%) 0402
- (in symbol RES_0402_1.33k_1%) 0402
- (in symbol RES_0402_4.7k_1%) 0402
- (in symbol RES_0402_5.62k_1%) 0402
- (in symbol RES_0402_267R_1%) 0402
- (in symbol RES_0402_536R_1%) 0402

### Library data of the parts
C279 C284 C285 = CAP_0805_1µF_50V: Multilayer Ceramic Capacitors MLCC - SMD/SMT 0805 50VDC; Manufacturer 1: Samsung Electro-Mechanics; Manufacturer 1 Prt. Nr.: CL21B105KBFNNNG; Manufacturer 2 Prt. Nr.: UMK212BJ105KGHT; Manufacturer 2: Taiyo Yuden
C281-C283 = CAP_D10L12.5_330µF_25V: Organische Polymer-Aluminiumkondensatoren 330uF 25 Volts 20% AEC-Q200; Manufacturer 1: Würth Elektronik; Manufacturer 1 Prt. Nr.: 870025575009
C286 C290 = CAP_0402_100nF_50V: as C185 on sheet I2C Multiplexer; Manufacturer 2: TDK
C287-C289 C291 C292 = CAP_0402_10nF_50V: Multilayer Ceramic Capacitors MLCC - SMD/SMT 0402 50VDC; Manufacturer 1: Wurth Elektronik; Manufacturer 1 Prt. Nr.: 885012205067; Manufacturer 2 Prt. Nr.: AC0402KPX7R9BB103; Manufacturer 2: Yageo
D72 = SMB15F18A_ESD-Entstörer/TVS-Dioden 1500 W, 18 V TVS: ESD-Entstörer/TVS-Dioden 1500 W, 18 V TVS; Manufacturer 1: STMicroelectronics; Manufacturer 1 Prt. Nr.: SMB15F18A
D73 = LED 0603 Blue Sideview: BLUE  0603 Light Emitting Diode; Manufacturer 1: lite-On; Manufacturer 1 Prt. Nr.: LTST-S270TBKT; Color: Blue
F1 = 015406.3_SMD Ceramic Holder with Fuse - Fast 6.3A: SMD Ceramic Holder with Fuse - Fast 6.3A; Manufacturer 1: Littelfuse; Manufacturer 1 Prt. Nr.: 015406.3
J26 = 87427-0602_Mini-Fit Jr. Right angle Header, 4.20mm Pitch, Dual Row, 6 Circuits: Mini-Fit Jr. Right angle Header, 4.20mm Pitch, Dual Row, 6 Circuits; Manufacturer 1: MOLEX; Manufacturer 1 Prt. Nr.: 874270602
R212 R216 R217 R219 R224 R225 R228 = RES_0402_4.7k_1%: as R211 on sheet System Clocks; Manufacturer 2: Yageo
R213 = RES_0402_5.62k_1%: Thick Film Resistors - SMD 5.62kOhm 1%; Manufacturer 1: Vishay / Dale; Manufacturer 1 Prt. Nr.: CRCW04025K62FKEDC; Manufacturer 2 Prt. Nr.: AC0402FR-7W5K62L; Manufacturer 2: Yageo
R214 R218 R221 R223 R227 = RES_0402_1.07k_1%: Thick Film Resistors - SMD 1.07kOhm 1%; Manufacturer 1: Vishay / Dale; Manufacturer 1 Prt. Nr.: CRCW04021K07FKEDC; Manufacturer 2 Prt. Nr.: AC0402FR-071K07L; Manufacturer 2: Yageo
R215 R226 = RES_0402_267R_1%: Thick Film Resistors - SMD 267Ohm 1%; Manufacturer 1: Vishay / Dale; Manufacturer 1 Prt. Nr.: CRCW0402267RFKED; Manufacturer 2 Prt. Nr.: RC0402FR-07267RL; Manufacturer 2: Yageo
R220 R229 = RES_0402_1.33k_1%: Thick Film Resistors - SMD 1.33kOhm 1%; Manufacturer 1: Vishay / Dale; Manufacturer 1 Prt. Nr.: CRCW04021K33FKEDC; Manufacturer 2 Prt. Nr.: AC0402FR-071K33L; Manufacturer 2: Yageo
R222 = RES_0402_536R_1%: Thick Film Resistors - SMD 536Ohm 1%; Manufacturer 1: Vishay / Dale; Manufacturer 1 Prt. Nr.: CRCW0402536RFKED; Manufacturer 2 Prt. Nr.: RC0402FR-07536RL; Manufacturer 2: Yageo
S13 = 7101MD9AV2BE_Kippschalter SPDT Right Angle Vertical: Kippschalter SPDT Right Angle Vertical; Manufacturer 1: C&K; Manufacturer 1 Prt. Nr.: 7101MD9AV2BE
U25 = L7805CDT-TR_Linear Voltage Regulators 5.0V 1.0A: Linear Voltage Regulators 5.0V 1.0A Positive; Manufacturer 1: STMicroelectronics; Manufacturer 1 Prt. Nr.: L7805CDT-TR
U26 U27 = TPS37043BJOFDDFRQ1_Triple Supply Voltage Window Supervisors: Triple Supply Voltage Window Supervisors With Fixed Delay, Open Drain Output; Manufacturer 1: Texas Instruments; Manufacturer 1 Prt. Nr.: TPS37043BJOFDDFRQ1

## Sheet Buck Modules.SchDoc
size A3; SheetNumber: 22; SheetTotal: 22
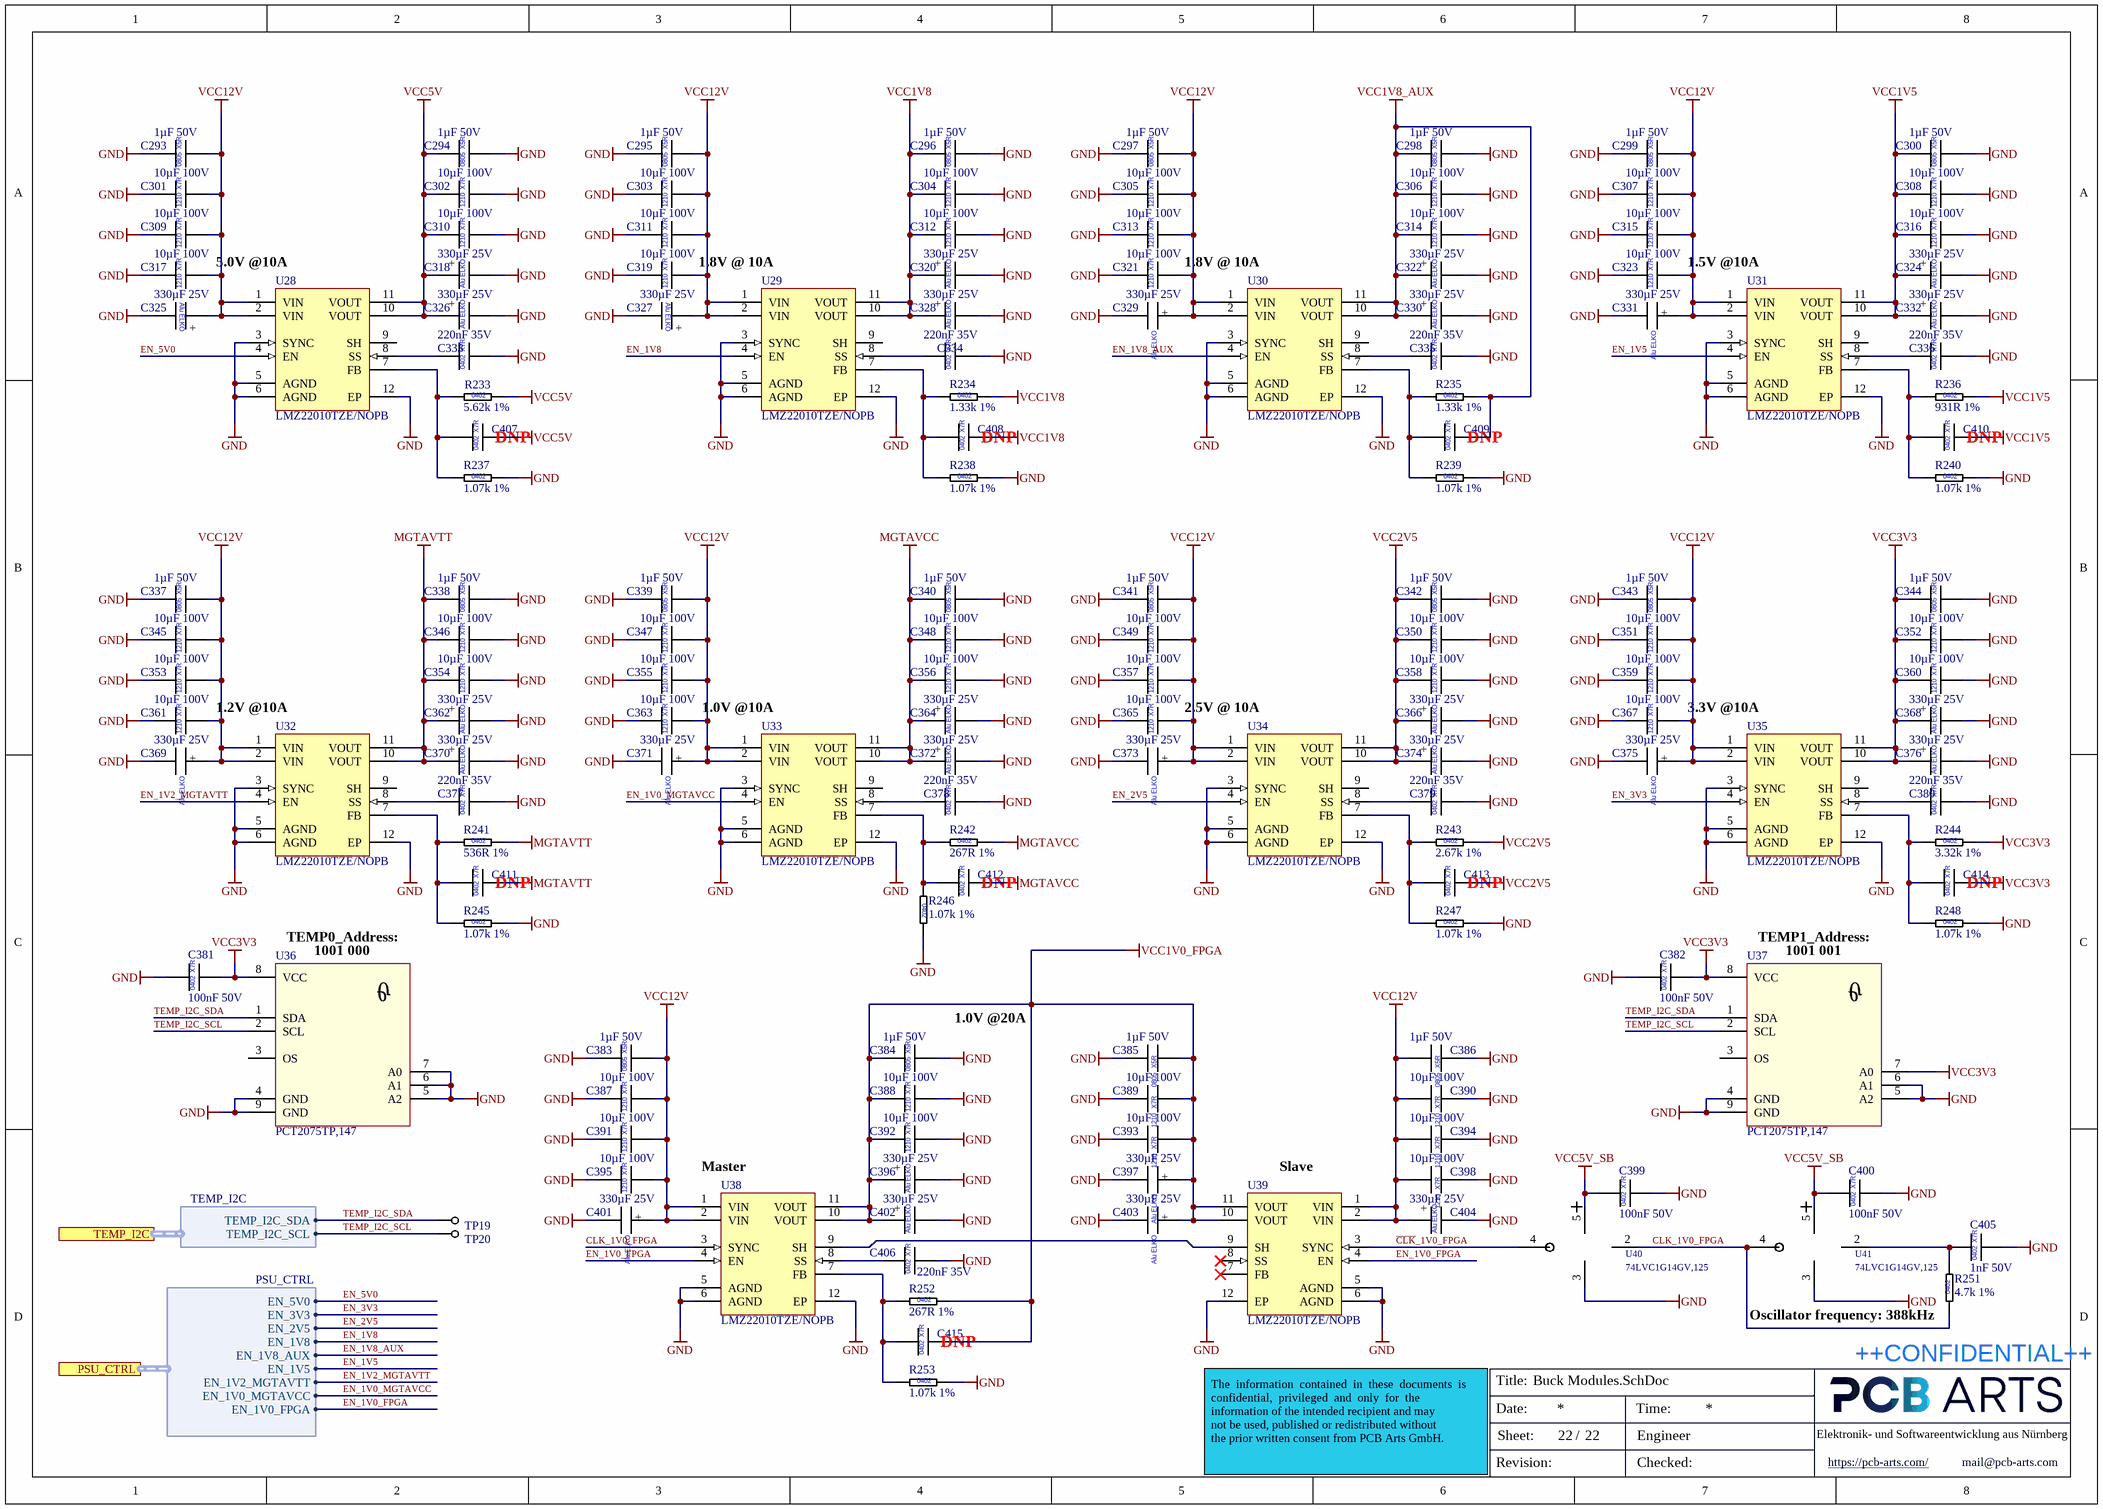
[diagram p20: Buck Modules.SchDoc]

### Parts
C293  1µF 50V  [CAP_0805]
C294  1µF 50V  [CAP_0805]
C295  1µF 50V  [CAP_0805]
C296  1µF 50V  [CAP_0805]
C297  1µF 50V  [CAP_0805]
C298  1µF 50V  [CAP_0805]
C299  1µF 50V  [CAP_0805]
C300  1µF 50V  [CAP_0805]
C301  10µF 100V  [CAP_1210]
C302  10µF 100V  [CAP_1210]
C303  10µF 100V  [CAP_1210]
C304  10µF 100V  [CAP_1210]
C305  10µF 100V  [CAP_1210]
C306  10µF 100V  [CAP_1210]
C307  10µF 100V  [CAP_1210]
C308  10µF 100V  [CAP_1210]
C309  10µF 100V  [CAP_1210]
C310  10µF 100V  [CAP_1210]
C311  10µF 100V  [CAP_1210]
C312  10µF 100V  [CAP_1210]
C313  10µF 100V  [CAP_1210]
C314  10µF 100V  [CAP_1210]
C315  10µF 100V  [CAP_1210]
C316  10µF 100V  [CAP_1210]
C317  10µF 100V  [CAP_1210]
C318  330µF 25V  [WCAP-PTG5_D10H12.5]
C319  10µF 100V  [CAP_1210]
C320  330µF 25V  [WCAP-PTG5_D10H12.5]
C321  10µF 100V  [CAP_1210]
C322  330µF 25V  [WCAP-PTG5_D10H12.5]
C323  10µF 100V  [CAP_1210]
C324  330µF 25V  [WCAP-PTG5_D10H12.5]
C325  330µF 25V  [WCAP-PTG5_D10H12.5]
C326  330µF 25V  [WCAP-PTG5_D10H12.5]
C327  330µF 25V  [WCAP-PTG5_D10H12.5]
C328  330µF 25V  [WCAP-PTG5_D10H12.5]
C329  330µF 25V  [WCAP-PTG5_D10H12.5]
C330  330µF 25V  [WCAP-PTG5_D10H12.5]
C331  330µF 25V  [WCAP-PTG5_D10H12.5]
C332  330µF 25V  [WCAP-PTG5_D10H12.5]
C333  220nF 35V  [CAP_0402_L]
C334  220nF 35V  [CAP_0402_L]
C335  220nF 35V  [CAP_0402_L]
C336  220nF 35V  [CAP_0402_L]
C337  1µF 50V  [CAP_0805]
C338  1µF 50V  [CAP_0805]
C339  1µF 50V  [CAP_0805]
C340  1µF 50V  [CAP_0805]
C341  1µF 50V  [CAP_0805]
C342  1µF 50V  [CAP_0805]
C343  1µF 50V  [CAP_0805]
C344  1µF 50V  [CAP_0805]
C345  10µF 100V  [CAP_1210]
C346  10µF 100V  [CAP_1210]
C347  10µF 100V  [CAP_1210]
C348  10µF 100V  [CAP_1210]
C349  10µF 100V  [CAP_1210]
C350  10µF 100V  [CAP_1210]
C351  10µF 100V  [CAP_1210]
C352  10µF 100V  [CAP_1210]
C353  10µF 100V  [CAP_1210]
C354  10µF 100V  [CAP_1210]
C355  10µF 100V  [CAP_1210]
C356  10µF 100V  [CAP_1210]
C357  10µF 100V  [CAP_1210]
C358  10µF 100V  [CAP_1210]
C359  10µF 100V  [CAP_1210]
C360  10µF 100V  [CAP_1210]
C361  10µF 100V  [CAP_1210]
C362  330µF 25V  [WCAP-PTG5_D10H12.5]
C363  10µF 100V  [CAP_1210]
C364  330µF 25V  [WCAP-PTG5_D10H12.5]
C365  10µF 100V  [CAP_1210]
C366  330µF 25V  [WCAP-PTG5_D10H12.5]
C367  10µF 100V  [CAP_1210]
C368  330µF 25V  [WCAP-PTG5_D10H12.5]
C369  330µF 25V  [WCAP-PTG5_D10H12.5]
C370  330µF 25V  [WCAP-PTG5_D10H12.5]
C371  330µF 25V  [WCAP-PTG5_D10H12.5]
C372  330µF 25V  [WCAP-PTG5_D10H12.5]
C373  330µF 25V  [WCAP-PTG5_D10H12.5]
C374  330µF 25V  [WCAP-PTG5_D10H12.5]
C375  330µF 25V  [WCAP-PTG5_D10H12.5]
C376  330µF 25V  [WCAP-PTG5_D10H12.5]
C377  220nF 35V  [CAP_0402_L]
C378  220nF 35V  [CAP_0402_L]
C379  220nF 35V  [CAP_0402_L]
C380  220nF 35V  [CAP_0402_L]
C381  100nF 50V  [CAP_0402_L]
C382  100nF 50V  [CAP_0402_L]
C383  1µF 50V  [CAP_0805]
C384  1µF 50V  [CAP_0805]
C385  1µF 50V  [CAP_0805]
C386  1µF 50V  [CAP_0805]
C387  10µF 100V  [CAP_1210]
C388  10µF 100V  [CAP_1210]
C389  10µF 100V  [CAP_1210]
C390  10µF 100V  [CAP_1210]
C391  10µF 100V  [CAP_1210]
C392  10µF 100V  [CAP_1210]
C393  10µF 100V  [CAP_1210]
C394  10µF 100V  [CAP_1210]
C395  10µF 100V  [CAP_1210]
C396  330µF 25V  [WCAP-PTG5_D10H12.5]
C397  330µF 25V  [WCAP-PTG5_D10H12.5]
C398  10µF 100V  [CAP_1210]
C399  100nF 50V  [CAP_0402_L]
C400  100nF 50V  [CAP_0402_L]
C401  330µF 25V  [WCAP-PTG5_D10H12.5]
C402  330µF 25V  [WCAP-PTG5_D10H12.5]
C403  330µF 25V  [WCAP-PTG5_D10H12.5]
C404  330µF 25V  [WCAP-PTG5_D10H12.5]
C405  1nF 50V  [CAP_0402_L]
C406  220nF 35V  [CAP_0402_L]
C407  OPT  [CAP_0402_L]  (value not drawn)
C408  OPT  [CAP_0402_L]  (value not drawn)
C409  OPT  [CAP_0402_L]  (value not drawn)
C410  OPT  [CAP_0402_L]  (value not drawn)
C411  OPT  [CAP_0402_L]  (value not drawn)
C412  OPT  [CAP_0402_L]  (value not drawn)
C413  OPT  [CAP_0402_L]  (value not drawn)
C414  OPT  [CAP_0402_L]  (value not drawn)
C415  OPT  [CAP_0402_L]  (value not drawn)
R233  5.62k 1%  [RES_0402_L]
R234  1.33k 1%  [RES_0402_L]
R235  1.33k 1%  [RES_0402_L]
R236  931R 1%  [RES_0402_L]
R237  1.07k 1%  [RES_0402_L]
R238  1.07k 1%  [RES_0402_L]
R239  1.07k 1%  [RES_0402_L]
R240  1.07k 1%  [RES_0402_L]
R241  536R 1%  [RES_0402_L]
R242  267R 1%  [RES_0402_L]
R243  2.67k 1%  [RES_0402_L]
R244  3.32k 1%  [RES_0402_L]
R245  1.07k 1%  [RES_0402_L]
R246  1.07k 1%  [RES_0402_L]
R247  1.07k 1%  [RES_0402_L]
R248  1.07k 1%  [RES_0402_L]
R251  4.7k 1%  [RES_0402_L]
R252  267R 1%  [RES_0402_L]
R253  1.07k 1%  [RES_0402_L]
TP19  Testpoint  [Testpoint 0.8mm]  (value not drawn)  (no BOM)
TP20  Testpoint  [Testpoint 0.8mm]  (value not drawn)  (no BOM)
U28  LMZ22010TZE/NOPB  [TI Simpleswitcher NDY0011A_N]
U29  LMZ22010TZE/NOPB  [TI Simpleswitcher NDY0011A_N]
U30  LMZ22010TZE/NOPB  [TI Simpleswitcher NDY0011A_N]
U31  LMZ22010TZE/NOPB  [TI Simpleswitcher NDY0011A_N]
U32  LMZ22010TZE/NOPB  [TI Simpleswitcher NDY0011A_N]
U33  LMZ22010TZE/NOPB  [TI Simpleswitcher NDY0011A_N]
U34  LMZ22010TZE/NOPB  [TI Simpleswitcher NDY0011A_N]
U35  LMZ22010TZE/NOPB  [TI Simpleswitcher NDY0011A_N]
U36  PCT2075TP,147  [SOT1069-2 (HWSON8)]
U37  PCT2075TP,147  [SOT1069-2 (HWSON8)]
U38  LMZ22010TZE/NOPB  [TI Simpleswitcher NDY0011A_N]
U39  LMZ22010TZE/NOPB  [TI Simpleswitcher NDY0011A_N]
U40  74LVC1G14GV,125  [SOT95P275X110-5N]
U41  74LVC1G14GV,125  [SOT95P275X110-5N]

### Ports
PSU_CTRL (harness PSU_CTRL, see Top-Level-Sheet[6C], PWR_CTRL[1D]), TEMP_I2C (harness TEMP_I2C, see Top-Level-Sheet[6C], SMI Bank 12[1C])

### Harnesses
PSU_CTRL: EN_1V8_AUX, EN_1V5, EN_1V2_MGTAVTT, EN_1V0_MGTAVCC, EN_1V8, EN_1V0_FPGA, EN_2V5, EN_3V3, EN_5V0
TEMP_I2C: TEMP_I2C_SCL, TEMP_I2C_SDA

### Nets
GND: C293.1 C294.2 C295.1 C296.2 C297.1 C298.2 C299.1 C300.2 C301.1 C302.2 C303.1 C304.2 C305.1 C306.2 C307.1 C308.2 C309.1 C310.2 C311.1 C312.2 C313.1 C314.2 C315.1 C316.2 C317.1 C318.2 C319.1 C320.2 C321.1 C322.2 C323.1 C324.2 C325.2 C326.2 C327.2 C328.2 C329.2 C330.2 C331.2 C332.2 C333.2 C334.2 C335.2 C336.2 C337.1 C338.2 C339.1 C340.2 C341.1 C342.2 C343.1 C344.2 C345.1 C346.2 C347.1 C348.2 C349.1 C350.2 C351.1 C352.2 C353.1 C354.2 C355.1 C356.2 C357.1 C358.2 C359.1 C360.2 C361.1 C362.2 C363.1 C364.2 C365.1 C366.2 C367.1 C368.2 C369.2 C370.2 C371.2 C372.2 C373.2 C374.2 C375.2 C376.2 C377.2 C378.2 C379.2 C380.2 C381.1 C382.1 C383.1 C384.2 C385.2 C386.1 C387.1 C388.2 C389.2 C390.1 C391.1 C392.2 C393.2 C394.1 C395.1 C396.2 C397.2 C398.1 C399.2 C400.2 C401.2 C402.2 C403.2 C404.2 C405.2 C406.2 R237.2 R238.2 R239.2 R240.2 R245.2 R246.2 R247.2 R248.2 R253.2 U28.3(SYNC) U28.5(AGND) U28.6(AGND) U28.12(EP) U29.3(SYNC) U29.5(AGND) U29.6(AGND) U29.12(EP) U30.3(SYNC) U30.5(AGND) U30.6(AGND) U30.12(EP) U31.3(SYNC) U31.5(AGND) U31.6(AGND) U31.12(EP) U32.3(SYNC) U32.5(AGND) U32.6(AGND) U32.12(EP) U33.3(SYNC) U33.5(AGND) U33.6(AGND) U33.12(EP) U34.3(SYNC) U34.5(AGND) U34.6(AGND) U34.12(EP) U35.3(SYNC) U35.5(AGND) U35.6(AGND) U35.12(EP) U36.4(GND) U36.5(A2) U36.6(A1) U36.7(A0) U36.9(GND) U37.4(GND) U37.5(A2) U37.6(A1) U37.9(GND) U38.5(AGND) U38.6(AGND) U38.12(EP) U39.5(AGND) U39.6(AGND) U39.12(EP) U40.3(GND) U41.3(GND)
MGTAVCC: C340.1 C348.1 C356.1 C364.1 C372.1 C412.2 R242.2 U33.10(VOUT) U33.11(VOUT)
MGTAVTT: C338.1 C346.1 C354.1 C362.1 C370.1 C411.2 R241.2 U32.10(VOUT) U32.11(VOUT)
VCC1V0_FPGA: C384.1 C385.1 C388.1 C389.1 C392.1 C393.1 C396.1 C397.1 C402.1 C403.1 C415.2 R252.2 U38.10(VOUT) U38.11(VOUT) U39.10(VOUT) U39.11(VOUT)
VCC1V5: C300.1 C308.1 C316.1 C324.1 C332.1 C410.2 R236.2 U31.10(VOUT) U31.11(VOUT)
VCC1V8: C296.1 C304.1 C312.1 C320.1 C328.1 C408.2 R234.2 U29.10(VOUT) U29.11(VOUT)
VCC1V8_AUX: C298.1 C306.1 C314.1 C322.1 C330.1 C409.2 R235.2 U30.10(VOUT) U30.11(VOUT)
VCC2V5: C342.1 C350.1 C358.1 C366.1 C374.1 C413.2 R243.2 U34.10(VOUT) U34.11(VOUT)
VCC3V3: C344.1 C352.1 C360.1 C368.1 C376.1 C381.2 C382.2 C414.2 R244.2 U35.10(VOUT) U35.11(VOUT) U36.8(VCC) U37.7(A0) U37.8(VCC)
VCC5V: C294.1 C302.1 C310.1 C318.1 C326.1 C407.2 R233.2 U28.10(VOUT) U28.11(VOUT)
VCC5V_SB: C399.1 C400.1 U40.5(VCC) U41.5(VCC)
VCC12V: C293.2 C295.2 C297.2 C299.2 C301.2 C303.2 C305.2 C307.2 C309.2 C311.2 C313.2 C315.2 C317.2 C319.2 C321.2 C323.2 C325.1 C327.1 C329.1 C331.1 C337.2 C339.2 C341.2 C343.2 C345.2 C347.2 C349.2 C351.2 C353.2 C355.2 C357.2 C359.2 C361.2 C363.2 C365.2 C367.2 C369.1 C371.1 C373.1 C375.1 C383.2 C386.2 C387.2 C390.2 C391.2 C394.2 C395.2 C398.2 C401.1 C404.1 U28.1(VIN) U28.2(VIN) U29.1(VIN) U29.2(VIN) U30.1(VIN) U30.2(VIN) U31.1(VIN) U31.2(VIN) U32.1(VIN) U32.2(VIN) U33.1(VIN) U33.2(VIN) U34.1(VIN) U34.2(VIN) U35.1(VIN) U35.2(VIN) U38.1(VIN) U38.2(VIN) U39.1(VIN) U39.2(VIN)
~{CLK}_1V0_FPGA: U39.3(SYNC) U40.4(Y)
CLK_1V0_FPGA: R251.1 U38.3(SYNC) U40.2(A) U41.4(Y)
EN_1V0_FPGA: U38.4(EN) U39.4(EN) ; port PSU_CTRL.EN_1V0_FPGA
EN_1V0_MGTAVCC: U33.4(EN) ; port PSU_CTRL.EN_1V0_MGTAVCC
EN_1V2_MGTAVTT: U32.4(EN) ; port PSU_CTRL.EN_1V2_MGTAVTT
EN_1V5: U31.4(EN) ; port PSU_CTRL.EN_1V5
EN_1V8: U29.4(EN) ; port PSU_CTRL.EN_1V8
EN_1V8_AUX: U30.4(EN) ; port PSU_CTRL.EN_1V8_AUX
EN_2V5: U34.4(EN) ; port PSU_CTRL.EN_2V5
EN_3V3: U35.4(EN) ; port PSU_CTRL.EN_3V3
EN_5V0: U28.4(EN) ; port PSU_CTRL.EN_5V0
TEMP_I2C_SCL: TP20.1(GND) U36.2(SCL) U37.2(SCL) ; port TEMP_I2C.TEMP_I2C_SCL
TEMP_I2C_SDA: TP19.1(GND) U36.1(SDA) U37.1(SDA) ; port TEMP_I2C.TEMP_I2C_SDA
NetC333_1: C333.1 U28.8(SS)
NetC334_1: C334.1 U29.8(SS)
NetC335_1: C335.1 U30.8(SS)
NetC336_1: C336.1 U31.8(SS)
NetC377_1: C377.1 U32.8(SS)
NetC378_1: C378.1 U33.8(SS)
NetC379_1: C379.1 U34.8(SS)
NetC380_1: C380.1 U35.8(SS)
NetC405_1: C405.1 R251.2 U41.2(A)
NetC406_1: C406.1 U38.8(SS)
NetC407_1: C407.1 R233.1 R237.1 U28.7(FB)
NetC408_1: C408.1 R234.1 R238.1 U29.7(FB)
NetC409_1: C409.1 R235.1 R239.1 U30.7(FB)
NetC410_1: C410.1 R236.1 R240.1 U31.7(FB)
NetC411_1: C411.1 R241.1 R245.1 U32.7(FB)
NetC412_1: C412.1 R242.1 R246.1 U33.7(FB)
NetC413_1: C413.1 R243.1 R247.1 U34.7(FB)
NetC414_1: C414.1 R244.1 R248.1 U35.7(FB)
NetC415_1: C415.1 R252.1 R253.1 U38.7(FB)
NetU38_9: U38.9(SH) U39.9(SH)

Not connected (* = marked no-connect by the designer): U28 9(SH); U29 9(SH); U30 9(SH); U31 9(SH); U32 9(SH); U33 9(SH); U34 9(SH); U35 9(SH); U36 3(OS); U37 3(OS); U39 7(FB)* 8(SS)*

### Notes on the sheet
- (near U28) 5.0V @10A
- (near U29) 1.8V @ 10A
- (near U30) 1.8V @ 10A
- (near U31) 1.5V @10A
- (near C407) DNP
- (near C408) DNP
- (near C409) DNP
- (near C410) DNP
- (near U32) 1.2V @10A
- (near U33) 1.0V @10A
- (near U34) 2.5V @ 10A
- (near U35) 3.3V @10A
- (near C411) DNP
- (near C412) DNP
- (near C413) DNP
- (near C414) DNP
- (near U36) TEMP0_Address:
- (near U36) 1001 000
- (near U37) TEMP1_Address:
- (near U37) 1001 001
- 1.0V @20A
- (near U38) Master
- (near U39) Slave
- (near R251) Oscillator frequency: 388kHz
- (near C415) DNP
- Title:
- ++CONFIDENTIAL++
- Date:
- Sheet:
- /
- Time:
- Engineer
- Elektronik- und Softwareentwicklung aus Nürnberg
- The  information  contained  in  these  documents  is  confidential,  privileged  and  only  for  the
  information of the intended recipient and may
  not be used, published or redistributed without
  the prior written consent from PCB Arts GmbH.
- Revision:
- Checked:
- https://pcb-arts.com/
- mail@pcb-arts.com
- (in symbol CAP_0402_1nF_50V) X7R; 0402
- (in symbol CAP_0402_100nF_50V) X7R; 0402
- (in symbol CAP_0402_220nF_35V) X7R; 0402
- (in symbol CAP_0402_OPT) X7R; 0402
- (in symbol CAP_0805_1µF_50V) X5R; 0805
- (in symbol CAP_1210_10µF_100V) X7R; 1210
- (in symbol CAP_D10L12.5_330µF_25V) Alu ELKO; +
- (in symbol PCT2075TP,147) ϑ
- (in symbol RES_0402_1.07k_1%) 0402
- (in symbol RES_0402_1.33k_1%) 0402
- (in symbol RES_0402_2.67k_1%) 0402
- (in symbol RES_0402_3.32k_1%) 0402
- (in symbol RES_0402_4.7k_1%) 0402
- (in symbol RES_0402_5.62k_1%) 0402
- (in symbol RES_0402_267R_1%) 0402
- (in symbol RES_0402_536R_1%) 0402
- (in symbol RES_0402_931R_1%) 0402

### Library data of the parts
C293-C300 C337-C344 C383-C386 = CAP_0805_1µF_50V: as C279 on sheet PWR_CTRL; Manufacturer 2: Taiyo Yuden
C301-C317 C319 C321 C323 C345-C361 C363 C365 C367 C387-C395 C398 = CAP_1210_10µF_100V: Multilayer Ceramic Capacitors MLCC - SMD/SMT 1210 100VDC; Manufacturer 1: Murata Electronics; Manufacturer 1 Prt. Nr.: GRM32EC72A106ME05L; Manufacturer 2 Prt. Nr.: C3225X7R2A106K250AC; Manufacturer 2: TDK
C318 C320 C322 C324-C332 C362 C364 C366 C368-C376 C396 C397 C401-C404 = CAP_D10L12.5_330µF_25V: as C281 on sheet PWR_CTRL
C333-C336 C377-C380 C406 = CAP_0402_220nF_35V: Multilayer Ceramic Capacitors MLCC - SMD/SMT 0402 35VDC; Manufacturer 1: Murata Electronics; Manufacturer 1 Prt. Nr.: GCM155R71C224ME02D; Manufacturer 2 Prt. Nr.: 885012105017; Manufacturer 2: Wurth Elektronik
C381 C382 C399 C400 = CAP_0402_100nF_50V: as C185 on sheet I2C Multiplexer; Manufacturer 2: TDK
C405 = CAP_0402_1nF_50V: Multilayer Ceramic Capacitors MLCC - SMD/SMT 0402 50VDC; Manufacturer 1: Murata Electronics; Manufacturer 1 Prt. Nr.: GRM155R71H102JA01D; Manufacturer 2 Prt. Nr.: C0402C102J5RAC7411; Manufacturer 2: KEMET
C407-C415 = CAP_0402_OPT: as C193 on sheet System Clocks
R233 = RES_0402_5.62k_1%: as R213 on sheet PWR_CTRL; Manufacturer 2: Yageo
R234 R235 = RES_0402_1.33k_1%: as R220 on sheet PWR_CTRL; Manufacturer 2: Yageo
R236 = RES_0402_931R_1%: Thick Film Resistors - SMD 931Ohm 1%; Manufacturer 1: Vishay / Dale; Manufacturer 1 Prt. Nr.: CRCW0402931RFKED; Manufacturer 2 Prt. Nr.: RC0402FR-07931RL; Manufacturer 2: Yageo
R237-R240 R245-R248 R253 = RES_0402_1.07k_1%: as R214 on sheet PWR_CTRL; Manufacturer 2: Yageo
R241 = RES_0402_536R_1%: as R222 on sheet PWR_CTRL; Manufacturer 2: Yageo
R242 R252 = RES_0402_267R_1%: as R215 on sheet PWR_CTRL; Manufacturer 2: Yageo
R243 = RES_0402_2.67k_1%: Thick Film Resistors - SMD 2.67kOhm 1%; Manufacturer 1: Vishay / Dale; Manufacturer 1 Prt. Nr.: CRCW04022K67FKEDC; Manufacturer 2 Prt. Nr.: AC0402FR-072K67L; Manufacturer 2: Yageo
R244 = RES_0402_3.32k_1%: Thick Film Resistors - SMD 3.32kOhm 1%; Manufacturer 1: Vishay / Dale; Manufacturer 1 Prt. Nr.: CRCW04023K32FKEDC; Manufacturer 2 Prt. Nr.: AC0402FR-073K32L; Manufacturer 2: Yageo
R251 = RES_0402_4.7k_1%: as R211 on sheet System Clocks; Manufacturer 2: Yageo
TP19 TP20 = Testpoint 0.8mm
U28-U35 U38 U39 = LMZ22010TZE/NOPB_Power Module with 20V Maximum Input and Current Sharing: 10A SIMPLE SWITCHER® Power Module with 20V Maximum Input and Current Sharing; Manufacturer 1: Texas Instruments; ComponentLink1URL: http://www.ti.com/general/docs/lit/getliterature.tsp?genericPartNumber=LMZ22010&fileType=pdf; ComponentLink1Description: Datasheet URL; Manufacturer 1 Prt. Nr.: LMZ22010TZE/NOPB
U36 U37 = PCT2075TP,147: Digital Temp Sensor I2C; Manufacturer 1: NXP; Manufacturer 1 Prt. Nr.: PCT2075TP,147
U40 U41 = 74LVC1G14GV,125_Inverter Single inverting Schmitt trigger: Inverter Single inverting Schmitt trigger; Manufacturer 1: Nexperia; Manufacturer 1 Prt. Nr.: 74LVC1G14GV,125